# EAGLE design lines_master (EAGLE 8.1.1)

## Sheet 1 of 4: Master processor
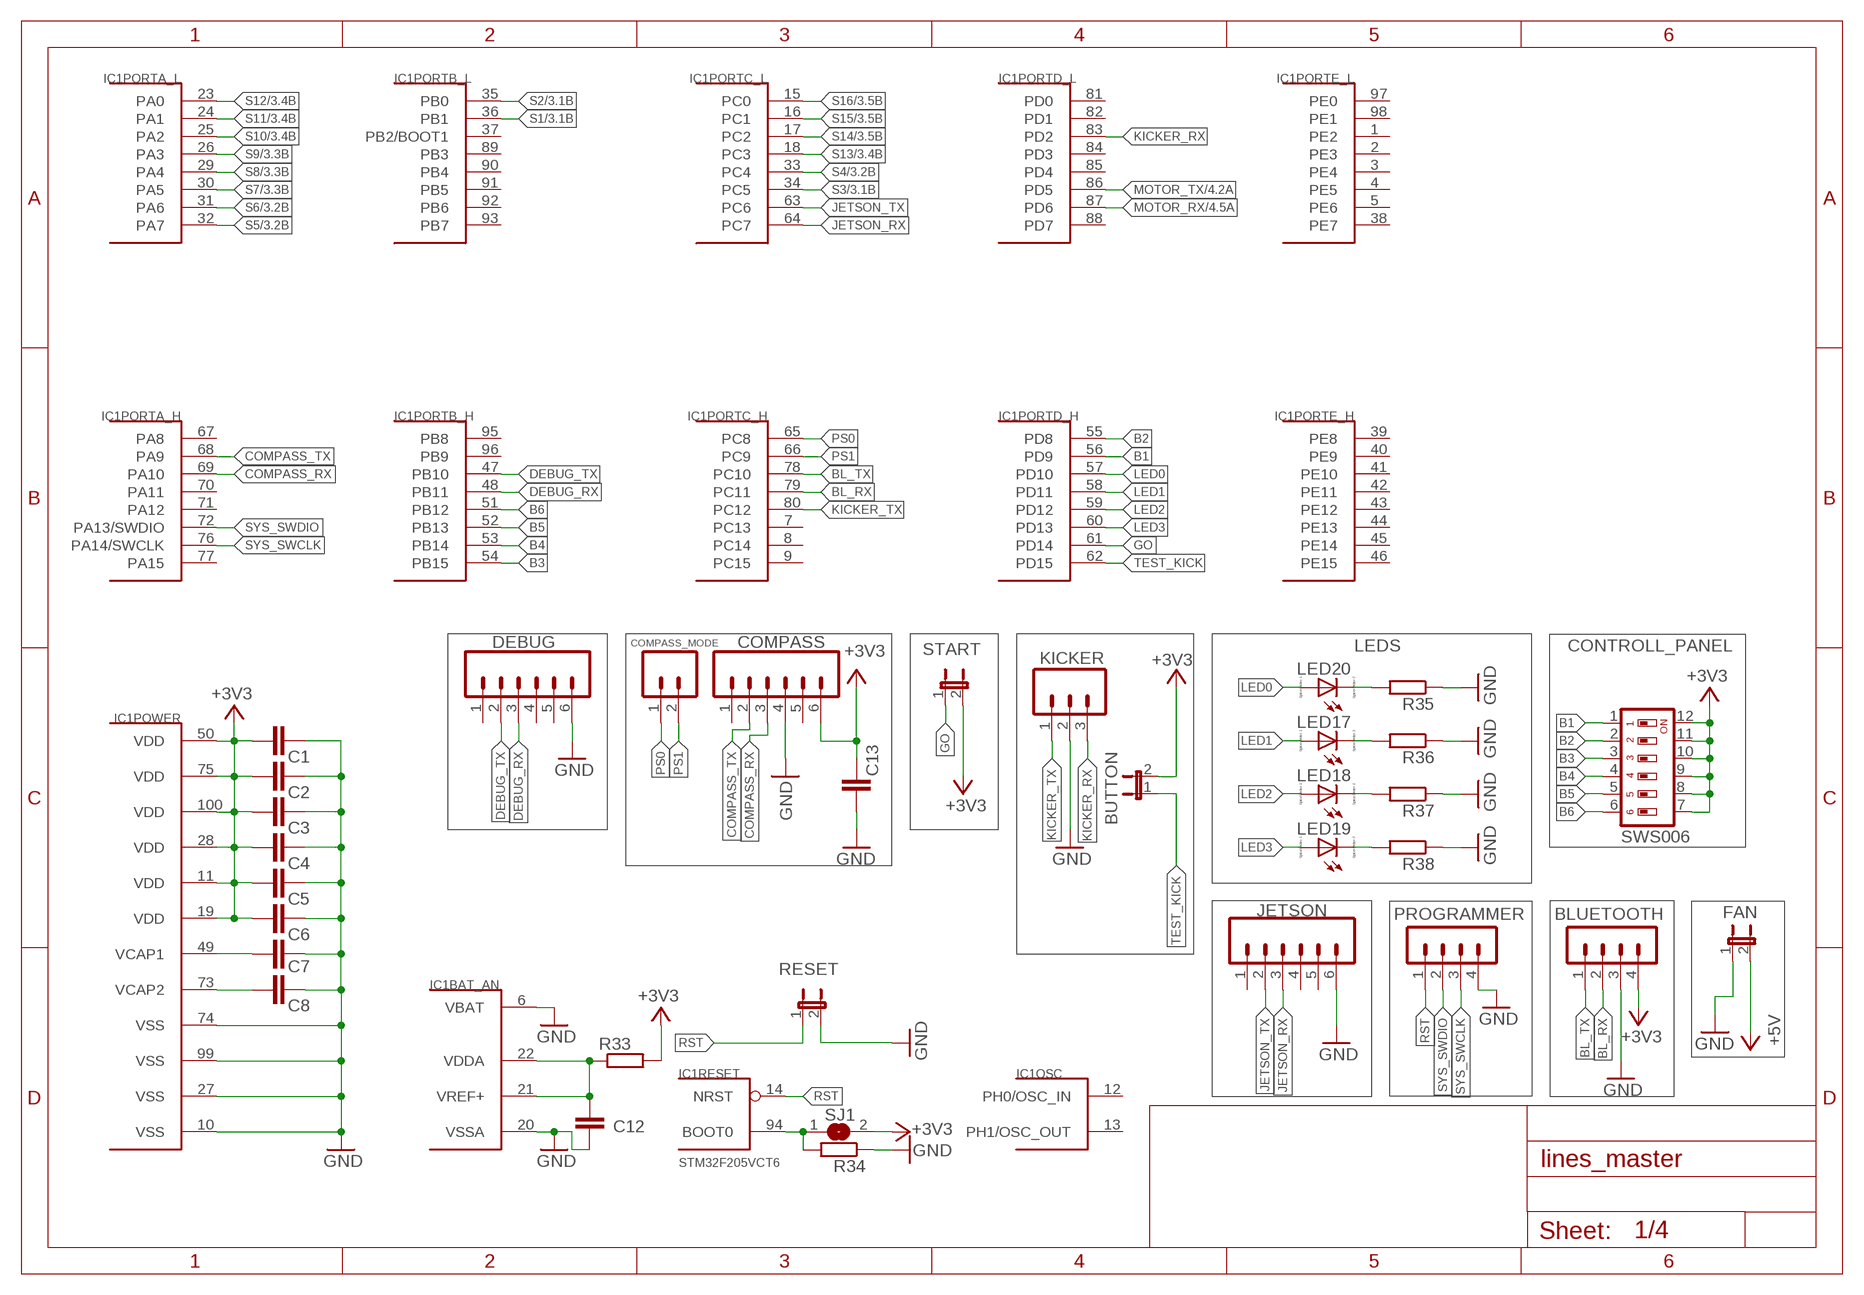
[diagram p0: schematic, sheet 1]

### Parts
BLUETOOTH  MA04-1  [MA04-1]
BUTTON  JP1E  [JP1]
C1  100K  C-EUC0603  [C0603]
C2  100K  C-EUC0603  [C0603]
C3  100K  C-EUC0603  [C0603]
C4  100K  C-EUC0603  [C0603]
C5  100K  C-EUC0603  [C0603]
C6  100K  C-EUC0603  [C0603]
C7  2M2  C-EUC0805  [C0805]
C8  2M2  C-EUC0805  [C0805]
C12  100K  C-EUC0603  [C0603]
C13  100K  C-EUC0603  [C0603]
COMPASS  M06  [06P]
COMPASS_MODE  M02  [02P]
CONTROLL_PANEL  SWS006  [SMS-006]
DEBUG  M06  [06P]
FAN  JP1E  [JP1]
IC1  STM32F205VCT6  [TQFP100]
JETSON  M06  [06P]
KICKER  M03  [03P]
LED17  LED_E  [LED_1206]
LED18  LED_E  [LED_1206]
LED19  LED_E  [LED_1206]
LED20  LED_E  [LED_1206]
PROGRAMMER  MA04-1  [MA04-1]
R33  R-EU_R1206  [R1206]
R34  R-EU_R0603  [R0603]
R35  R-EU_R0603  [R0603]
R36  R-EU_R0603  [R0603]
R37  R-EU_R0603  [R0603]
R38  R-EU_R0603  [R0603]
RESET  JP1E  [JP1]
SJ1  SJ  [SJ]
START  JP1E  [JP1]

### Nets
+3V3: BLUETOOTH.4 BUTTON.2 C1.2 C2.2 C3.2 C4.2 C5.2 C6.2 C13.1 COMPASS.6 CONTROLL_PANEL.7 CONTROLL_PANEL.8 CONTROLL_PANEL.9 CONTROLL_PANEL.10 CONTROLL_PANEL.11 CONTROLL_PANEL.12 IC1.11(POWER:VDD) IC1.19(POWER:VDD) IC1.28(POWER:VDD) IC1.50(POWER:VDD) IC1.75(POWER:VDD) IC1.100(POWER:VDD) R33.2 SJ1.2 START.2 ; also sheet 2,3
+5V: FAN.2 ; also sheet 2
B1: CONTROLL_PANEL.1 IC1.56(PORTD_H:PD9)
B2: CONTROLL_PANEL.2 IC1.55(PORTD_H:PD8)
B3: CONTROLL_PANEL.3 IC1.54(PORTB_H:PB15)
B4: CONTROLL_PANEL.4 IC1.53(PORTB_H:PB14)
B5: CONTROLL_PANEL.5 IC1.52(PORTB_H:PB13)
B6: CONTROLL_PANEL.6 IC1.51(PORTB_H:PB12)
BL_RX: BLUETOOTH.2 IC1.79(PORTC_H:PC11)
BL_TX: BLUETOOTH.1 IC1.78(PORTC_H:PC10)
COMPASS_RX: COMPASS.3 IC1.69(PORTA_H:PA10)
COMPASS_TX: COMPASS.2 IC1.68(PORTA_H:PA9)
DEBUG_RX: DEBUG.3 IC1.48(PORTB_H:PB11)
DEBUG_TX: DEBUG.2 IC1.47(PORTB_H:PB10)
GND: BLUETOOTH.3 C1.1 C2.1 C3.1 C4.1 C5.1 C6.1 C7.1 C8.1 C12.2 C13.2 COMPASS.4 DEBUG.6 FAN.1 IC1.6(BAT_AN:VBAT) IC1.10(POWER:VSS) IC1.20(BAT_AN:VSSA) IC1.27(POWER:VSS) IC1.74(POWER:VSS) IC1.99(POWER:VSS) JETSON.6 KICKER.2 PROGRAMMER.4 R34.1 R35.1 R36.1 R37.1 R38.1 RESET.2 ; also sheet 2,3,4
GO: IC1.61(PORTD_H:PD14) START.1
JETSON_RX: IC1.64(PORTC_L:PC7) JETSON.3
JETSON_TX: IC1.63(PORTC_L:PC6) JETSON.2
KICKER_RX: IC1.83(PORTD_L:PD2) KICKER.3
KICKER_TX: IC1.80(PORTC_H:PC12) KICKER.1
LED0: IC1.57(PORTD_H:PD10) LED20.A
LED1: IC1.58(PORTD_H:PD11) LED17.A
LED2: IC1.59(PORTD_H:PD12) LED18.A
LED3: IC1.60(PORTD_H:PD13) LED19.A
MOTOR_RX: IC1.87(PORTD_L:PD6) ; also sheet 4
MOTOR_TX: IC1.86(PORTD_L:PD5) ; also sheet 4
N$17: C7.2 IC1.49(POWER:VCAP1)
N$18: C8.2 IC1.73(POWER:VCAP2)
N$19: C12.1 IC1.21(BAT_AN:VREF+) IC1.22(BAT_AN:VDDA) R33.1
N$20: IC1.94(RESET:BOOT0) R34.2 SJ1.1
N$23: LED20.C R35.2
N$24: LED17.C R36.2
N$25: LED18.C R37.2
N$26: LED19.C R38.2
PS0: COMPASS_MODE.1 IC1.65(PORTC_H:PC8)
PS1: COMPASS_MODE.2 IC1.66(PORTC_H:PC9)
RST: IC1.14(RESET:NRST) PROGRAMMER.1 RESET.1
S1: IC1.36(PORTB_L:PB1) ; also sheet 3
S2: IC1.35(PORTB_L:PB0) ; also sheet 3
S3: IC1.34(PORTC_L:PC5) ; also sheet 3
S4: IC1.33(PORTC_L:PC4) ; also sheet 3
S5: IC1.32(PORTA_L:PA7) ; also sheet 3
S6: IC1.31(PORTA_L:PA6) ; also sheet 3
S7: IC1.30(PORTA_L:PA5) ; also sheet 3
S8: IC1.29(PORTA_L:PA4) ; also sheet 3
S9: IC1.26(PORTA_L:PA3) ; also sheet 3
S10: IC1.25(PORTA_L:PA2) ; also sheet 3
S11: IC1.24(PORTA_L:PA1) ; also sheet 3
S12: IC1.23(PORTA_L:PA0) ; also sheet 3
S13: IC1.18(PORTC_L:PC3) ; also sheet 3
S14: IC1.17(PORTC_L:PC2) ; also sheet 3
S15: IC1.16(PORTC_L:PC1) ; also sheet 3
S16: IC1.15(PORTC_L:PC0) ; also sheet 3
SYS_SWCLK: IC1.76(PORTA_H:PA14/SWCLK) PROGRAMMER.3
SYS_SWDIO: IC1.72(PORTA_H:PA13/SWDIO) PROGRAMMER.2
TEST_KICK: BUTTON.1 IC1.62(PORTD_H:PD15)
Unconnected: COMPASS.1 COMPASS.5 DEBUG.1 DEBUG.4 DEBUG.5 IC1.1(PORTE_L:PE2) IC1.2(PORTE_L:PE3) IC1.3(PORTE_L:PE4) IC1.4(PORTE_L:PE5) IC1.5(PORTE_L:PE6) IC1.7(PORTC_H:PC13) IC1.8(PORTC_H:PC14) IC1.9(PORTC_H:PC15) IC1.12(OSC:PH0/OSC_IN) IC1.13(OSC:PH1/OSC_OUT) IC1.37(PORTB_L:PB2/BOOT1) IC1.38(PORTE_L:PE7) IC1.39(PORTE_H:PE8) IC1.40(PORTE_H:PE9) IC1.41(PORTE_H:PE10) IC1.42(PORTE_H:PE11) IC1.43(PORTE_H:PE12) IC1.44(PORTE_H:PE13) IC1.45(PORTE_H:PE14) IC1.46(PORTE_H:PE15) IC1.67(PORTA_H:PA8) IC1.70(PORTA_H:PA11) IC1.71(PORTA_H:PA12) IC1.77(PORTA_H:PA15) IC1.81(PORTD_L:PD0) IC1.82(PORTD_L:PD1) IC1.84(PORTD_L:PD3) IC1.85(PORTD_L:PD4) IC1.88(PORTD_L:PD7) IC1.89(PORTB_L:PB3) IC1.90(PORTB_L:PB4) IC1.91(PORTB_L:PB5) IC1.92(PORTB_L:PB6) IC1.93(PORTB_L:PB7) IC1.95(PORTB_H:PB8) IC1.96(PORTB_H:PB9) IC1.97(PORTE_L:PE0) IC1.98(PORTE_L:PE1) JETSON.1 JETSON.4 JETSON.5

### Notes on the sheet
- LEDS

## Sheet 2 of 4: Power management
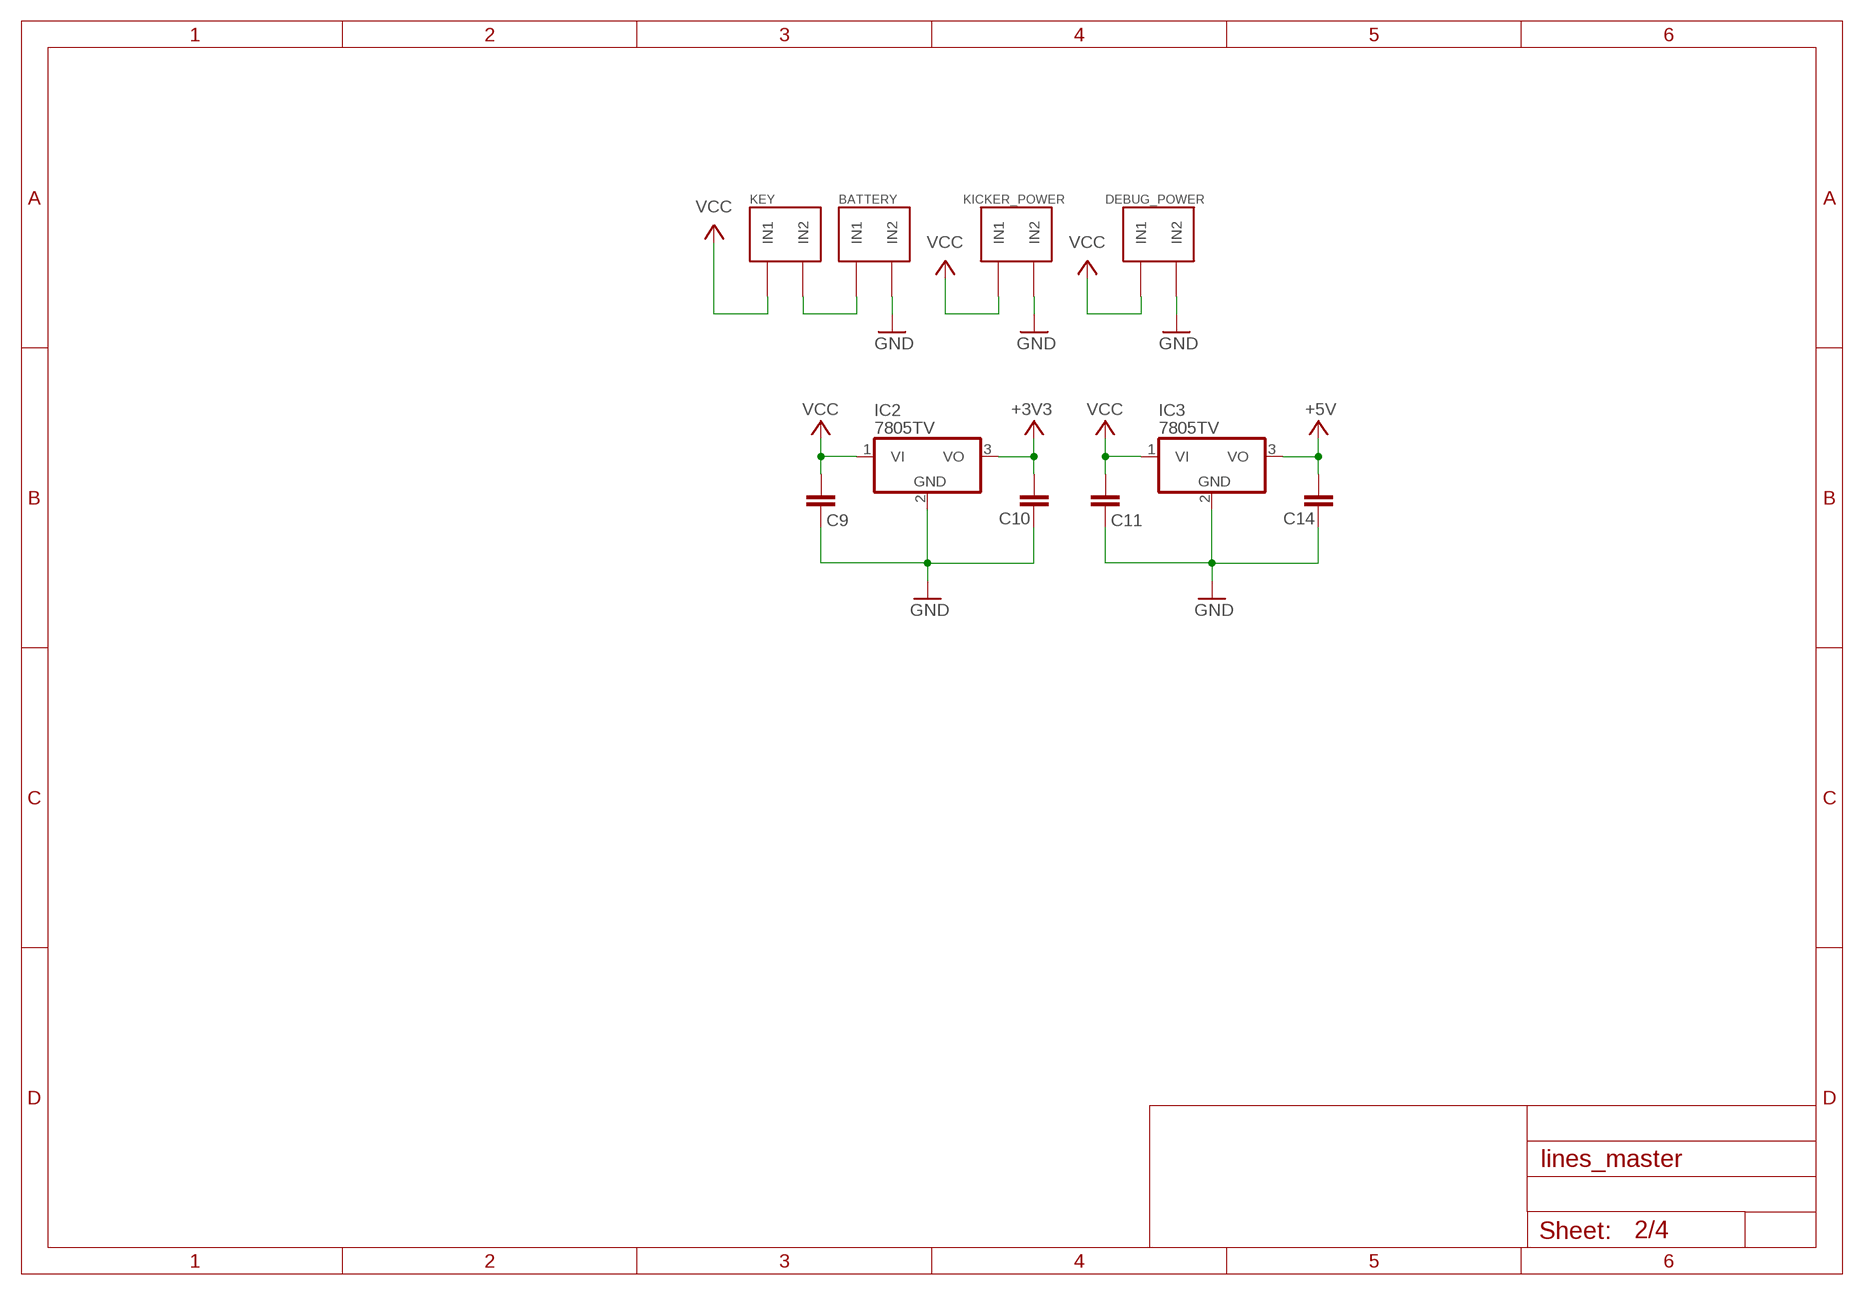
[diagram p1: schematic, sheet 2]

### Parts
BATTERY  MOTOR_CONNECTOR  [MOTOR_CONNECTOR]
C9  100K  C-EUC0603  [C0603]
C10  100K  C-EUC0603  [C0603]
C11  100K  C-EUC0603  [C0603]
C14  100K  C-EUC0603  [C0603]
DEBUG_POWER  MOTOR_CONNECTOR  [MOTOR_CONNECTOR]
IC2  7805TV  [TO220V]
IC3  7805TV  [TO220V]
KEY  MOTOR_CONNECTOR  [MOTOR_CONNECTOR]
KICKER_POWER  MOTOR_CONNECTOR  [MOTOR_CONNECTOR]

### Nets
+3V3: C10.2 IC2.3(VO) ; also sheet 1,3
+5V: C14.2 IC3.3(VO) ; also sheet 1
GND: BATTERY.IN2 C9.1 C10.1 C11.1 C14.1 DEBUG_POWER.IN2 IC2.2(GND) IC3.2(GND) KICKER_POWER.IN2 ; also sheet 1,3,4
N$28: BATTERY.IN1 KEY.IN2
VCC: C9.2 C11.2 DEBUG_POWER.IN1 IC2.1(VI) IC3.1(VI) KEY.IN1 KICKER_POWER.IN1 ; also sheet 4

## Sheet 3 of 4: Line sensors
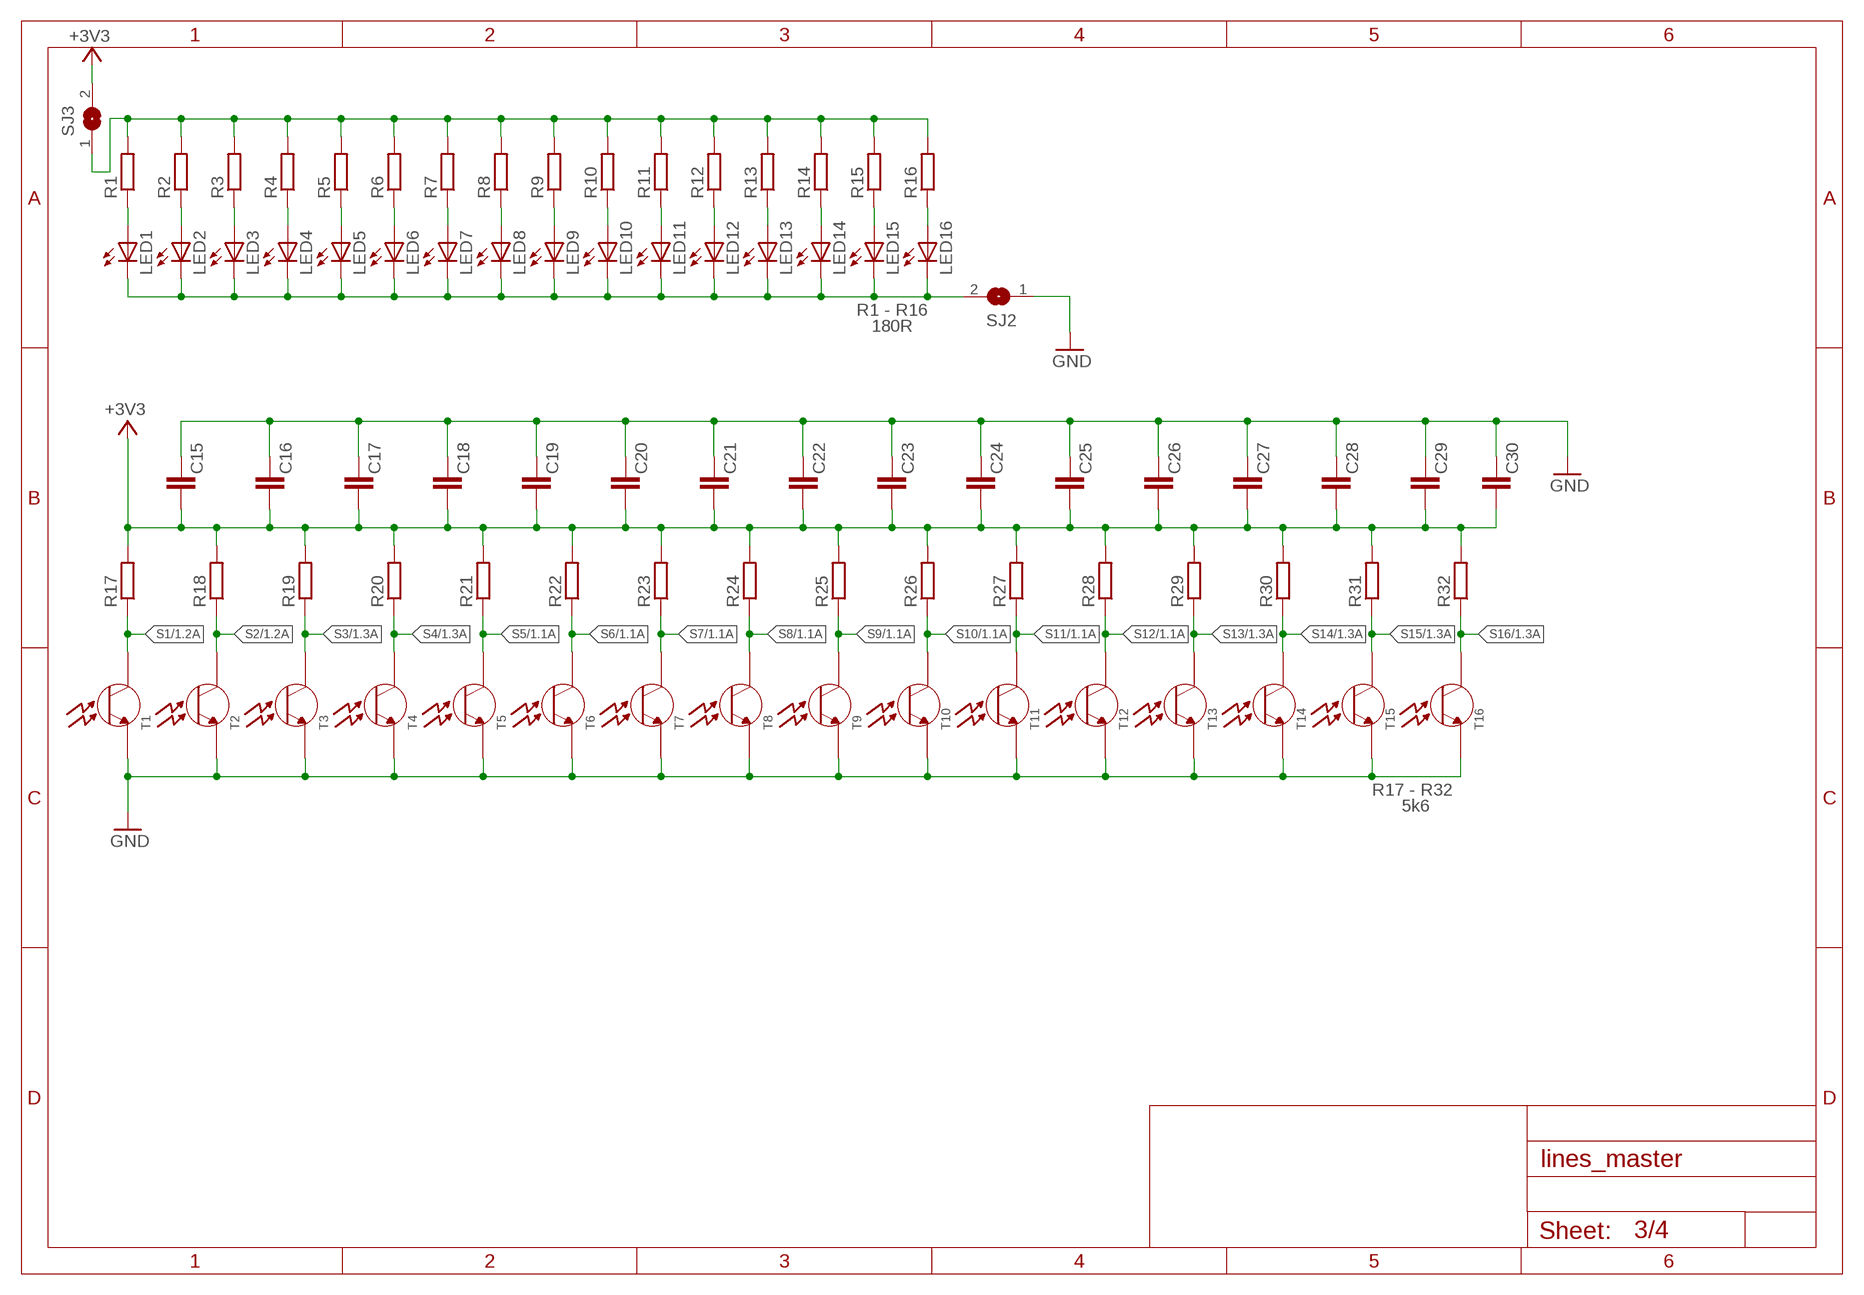
[diagram p2: schematic, sheet 3]

### Parts
C15  100K  C-EUC0603  [C0603]
C16  100K  C-EUC0603  [C0603]
C17  100K  C-EUC0603  [C0603]
C18  100K  C-EUC0603  [C0603]
C19  100K  C-EUC0603  [C0603]
C20  100K  C-EUC0603  [C0603]
C21  100K  C-EUC0603  [C0603]
C22  100K  C-EUC0603  [C0603]
C23  100K  C-EUC0603  [C0603]
C24  100K  C-EUC0603  [C0603]
C25  100K  C-EUC0603  [C0603]
C26  100K  C-EUC0603  [C0603]
C27  100K  C-EUC0603  [C0603]
C28  100K  C-EUC0603  [C0603]
C29  100K  C-EUC0603  [C0603]
C30  100K  C-EUC0603  [C0603]
LED1  LEDKA-3528ASYC  [KA-3528ASYC]
LED2  LEDKA-3528ASYC  [KA-3528ASYC]
LED3  LEDKA-3528ASYC  [KA-3528ASYC]
LED4  LEDKA-3528ASYC  [KA-3528ASYC]
LED5  LEDKA-3528ASYC  [KA-3528ASYC]
LED6  LEDKA-3528ASYC  [KA-3528ASYC]
LED7  LEDKA-3528ASYC  [KA-3528ASYC]
LED8  LEDKA-3528ASYC  [KA-3528ASYC]
LED9  LEDKA-3528ASYC  [KA-3528ASYC]
LED10  LEDKA-3528ASYC  [KA-3528ASYC]
LED11  LEDKA-3528ASYC  [KA-3528ASYC]
LED12  LEDKA-3528ASYC  [KA-3528ASYC]
LED13  LEDKA-3528ASYC  [KA-3528ASYC]
LED14  LEDKA-3528ASYC  [KA-3528ASYC]
LED15  LEDKA-3528ASYC  [KA-3528ASYC]
LED16  LEDKA-3528ASYC  [KA-3528ASYC]
R1  180R  R-EU_R0603  [R0603]
R2  180R  R-EU_R0603  [R0603]
R3  180R  R-EU_R0603  [R0603]
R4  180R  R-EU_R0603  [R0603]
R5  180R  R-EU_R0603  [R0603]
R6  180R  R-EU_R0603  [R0603]
R7  180R  R-EU_R0603  [R0603]
R8  180R  R-EU_R0603  [R0603]
R9  180R  R-EU_R0603  [R0603]
R10  180R  R-EU_R0603  [R0603]
R11  180R  R-EU_R0603  [R0603]
R12  180R  R-EU_R0603  [R0603]
R13  180R  R-EU_R0603  [R0603]
R14  180R  R-EU_R0603  [R0603]
R15  180R  R-EU_R0603  [R0603]
R16  180R  R-EU_R0603  [R0603]
R17  5K6  R-EU_R0603  [R0603]
R18  5K6  R-EU_R0603  [R0603]
R19  5K6  R-EU_R0603  [R0603]
R20  5K6  R-EU_R0603  [R0603]
R21  5K6  R-EU_R0603  [R0603]
R22  5K6  R-EU_R0603  [R0603]
R23  5K6  R-EU_R0603  [R0603]
R24  5K6  R-EU_R0603  [R0603]
R25  5K6  R-EU_R0603  [R0603]
R26  5K6  R-EU_R0603  [R0603]
R27  5K6  R-EU_R0603  [R0603]
R28  5K6  R-EU_R0603  [R0603]
R29  5K6  R-EU_R0603  [R0603]
R30  5K6  R-EU_R0603  [R0603]
R31  5K6  R-EU_R0603  [R0603]
R32  5K6  R-EU_R0603  [R0603]
SJ2  SJ  [SJ]
SJ3  SJ  [SJ]
T1  LL-S150-1A  [LL-S150PTC-1A]
T2  LL-S150-1A  [LL-S150PTC-1A]
T3  LL-S150-1A  [LL-S150PTC-1A]
T4  LL-S150-1A  [LL-S150PTC-1A]
T5  LL-S150-1A  [LL-S150PTC-1A]
T6  LL-S150-1A  [LL-S150PTC-1A]
T7  LL-S150-1A  [LL-S150PTC-1A]
T8  LL-S150-1A  [LL-S150PTC-1A]
T9  LL-S150-1A  [LL-S150PTC-1A]
T10  LL-S150-1A  [LL-S150PTC-1A]
T11  LL-S150-1A  [LL-S150PTC-1A]
T12  LL-S150-1A  [LL-S150PTC-1A]
T13  LL-S150-1A  [LL-S150PTC-1A]
T14  LL-S150-1A  [LL-S150PTC-1A]
T15  LL-S150-1A  [LL-S150PTC-1A]
T16  LL-S150-1A  [LL-S150PTC-1A]

### Nets
+3V3: C15.2 C16.2 C17.2 C18.2 C19.2 C20.2 C21.2 C22.2 C23.2 C24.2 C25.2 C26.2 C27.2 C28.2 C29.2 C30.2 R17.2 R18.2 R19.2 R20.2 R21.2 R22.2 R23.2 R24.2 R25.2 R26.2 R27.2 R28.2 R29.2 R30.2 R31.2 R32.2 SJ3.2 ; also sheet 1,2
GND: C15.1 C16.1 C17.1 C18.1 C19.1 C20.1 C21.1 C22.1 C23.1 C24.1 C25.1 C26.1 C27.1 C28.1 C29.1 C30.1 SJ2.1 T1.E T2.E T3.E T4.E T5.E T6.E T7.E T8.E T9.E T10.E T11.E T12.E T13.E T14.E T15.E T16.E ; also sheet 1,2,4
N$1: LED1.A R1.1
N$2: LED2.A R2.1
N$3: LED3.A R3.1
N$4: LED4.A R4.1
N$5: LED5.A R5.1
N$6: LED6.A R6.1
N$7: LED7.A R7.1
N$8: LED8.A R8.1
N$9: LED9.A R9.1
N$10: LED10.A R10.1
N$11: LED11.A R11.1
N$12: LED12.A R12.1
N$13: LED13.A R13.1
N$14: LED14.A R14.1
N$15: LED15.A R15.1
N$16: LED16.A R16.1
N$21: LED1.C LED2.C LED3.C LED4.C LED5.C LED6.C LED7.C LED8.C LED9.C LED10.C LED11.C LED12.C LED13.C LED14.C LED15.C LED16.C SJ2.2
N$22: R1.2 R2.2 R3.2 R4.2 R5.2 R6.2 R7.2 R8.2 R9.2 R10.2 R11.2 R12.2 R13.2 R14.2 R15.2 R16.2 SJ3.1
S1: R17.1 T1.C ; also sheet 1
S2: R18.1 T2.C ; also sheet 1
S3: R19.1 T3.C ; also sheet 1
S4: R20.1 T4.C ; also sheet 1
S5: R21.1 T5.C ; also sheet 1
S6: R22.1 T6.C ; also sheet 1
S7: R23.1 T7.C ; also sheet 1
S8: R24.1 T8.C ; also sheet 1
S9: R25.1 T9.C ; also sheet 1
S10: R26.1 T10.C ; also sheet 1
S11: R27.1 T11.C ; also sheet 1
S12: R28.1 T12.C ; also sheet 1
S13: R29.1 T13.C ; also sheet 1
S14: R30.1 T14.C ; also sheet 1
S15: R31.1 T15.C ; also sheet 1
S16: R32.1 T16.C ; also sheet 1

### Notes on the sheet
- R1 - R16
     180R
- R17 - R32
        5k6

## Sheet 4 of 4: Motors
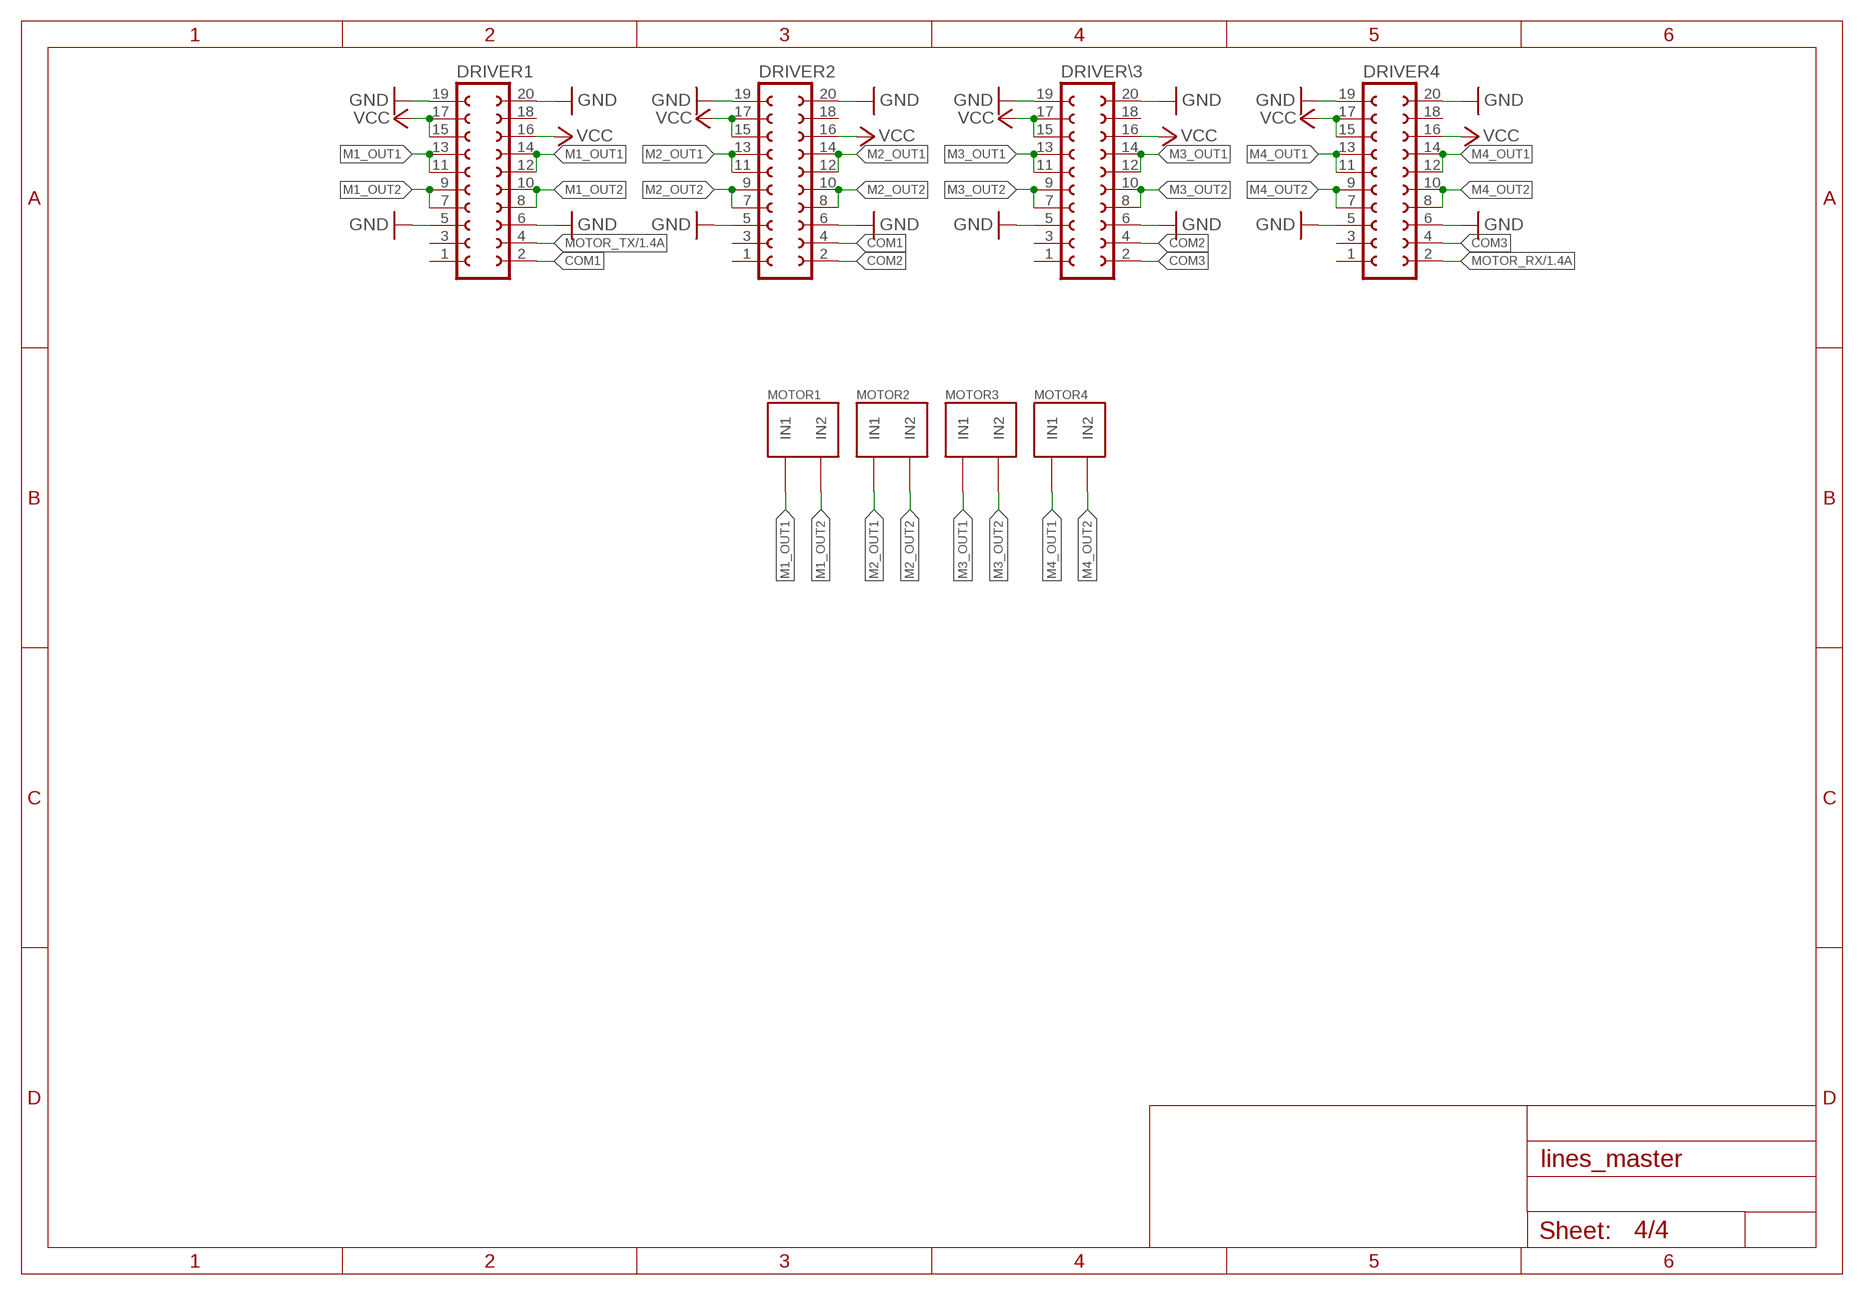
[diagram p3: schematic, sheet 4]

### Parts
DRIVER1  FE10-2  [FE10-2]
DRIVER2  FE10-2  [FE10-2]
DRIVER4  FE10-2  [FE10-2]
DRIVER\3  FE10-2  [FE10-2]
MOTOR1  MOTOR_CONNECTOR  [MOTOR_CONNECTOR]
MOTOR2  MOTOR_CONNECTOR  [MOTOR_CONNECTOR]
MOTOR3  MOTOR_CONNECTOR  [MOTOR_CONNECTOR]
MOTOR4  MOTOR_CONNECTOR  [MOTOR_CONNECTOR]

### Nets
COM1: DRIVER1.2 DRIVER2.4
COM2: DRIVER2.2 DRIVER\3.4
COM3: DRIVER4.4 DRIVER\3.2
GND: DRIVER1.5 DRIVER1.6 DRIVER1.19 DRIVER1.20 DRIVER2.5 DRIVER2.6 DRIVER2.19 DRIVER2.20 DRIVER4.5 DRIVER4.6 DRIVER4.19 DRIVER4.20 DRIVER\3.5 DRIVER\3.6 DRIVER\3.19 DRIVER\3.20 ; also sheet 1,2,3
M1_OUT1: DRIVER1.11 DRIVER1.12 DRIVER1.13 DRIVER1.14 MOTOR1.IN1
M1_OUT2: DRIVER1.7 DRIVER1.8 DRIVER1.9 DRIVER1.10 MOTOR1.IN2
M2_OUT1: DRIVER2.11 DRIVER2.12 DRIVER2.13 DRIVER2.14 MOTOR2.IN1
M2_OUT2: DRIVER2.7 DRIVER2.8 DRIVER2.9 DRIVER2.10 MOTOR2.IN2
M3_OUT1: DRIVER\3.11 DRIVER\3.12 DRIVER\3.13 DRIVER\3.14 MOTOR3.IN1
M3_OUT2: DRIVER\3.7 DRIVER\3.8 DRIVER\3.9 DRIVER\3.10 MOTOR3.IN2
M4_OUT1: DRIVER4.11 DRIVER4.12 DRIVER4.13 DRIVER4.14 MOTOR4.IN1
M4_OUT2: DRIVER4.7 DRIVER4.8 DRIVER4.9 DRIVER4.10 MOTOR4.IN2
MOTOR_RX: DRIVER4.2 ; also sheet 1
MOTOR_TX: DRIVER1.4 ; also sheet 1
VCC: DRIVER1.15 DRIVER1.16 DRIVER1.17 DRIVER2.15 DRIVER2.16 DRIVER2.17 DRIVER4.15 DRIVER4.16 DRIVER4.17 DRIVER\3.15 DRIVER\3.16 DRIVER\3.17 ; also sheet 2
Unconnected: DRIVER1.1 DRIVER1.3 DRIVER1.18 DRIVER2.1 DRIVER2.3 DRIVER2.18 DRIVER4.1 DRIVER4.3 DRIVER4.18 DRIVER\3.1 DRIVER\3.3 DRIVER\3.18

## Library data of the parts
BATTERY DEBUG_POWER KEY KICKER_POWER MOTOR1-MOTOR4 = motor_connector:MOTOR_CONNECTOR
BLUETOOTH PROGRAMMER = con-lstb:MA04-1: PIN HEADER; OC_FARNELL: unknown; OC_NEWARK: unknown
BUTTON FAN RESET START = jumper:JP1E: JUMPER
C1-C30 = rcl:C-EU: CAPACITOR, European symbol
COMPASS DEBUG JETSON = con-amp-quick:M06: AMP QUICK CONNECTOR; OC_FARNELL: unknown; OC_NEWARK: unknown
COMPASS_MODE = con-amp-quick:M02: AMP QUICK CONNECTOR; OC_FARNELL: unknown; OC_NEWARK: unknown
CONTROLL_PANEL = smd-special:SWS006: SMD Dip Switch 6 pol.
DRIVER1 DRIVER2 DRIVER4 DRIVER\3 = con-lsta:FE10-2: FEMALE HEADER; OC_FARNELL: unknown; OC_NEWARK: unknown
IC1 = stm32f205:STM32F205VCT6: STM32F101/103 100 pin LQFP
IC2 IC3 = linear:78*: Positive VOLTAGE REGULATOR Source: http://cache.national.com/ds/LM/LM78L05.pdf http://www.fairchildsemi.com/ds/LM/LM7805.pdf
KICKER = con-amp-quick:M03: AMP QUICK CONNECTOR; OC_FARNELL: unknown; OC_NEWARK: unknown
LED1-LED16 = led:LED: LED OSRAM: - CHIPLED LG R971, LG N971, LY N971, LG Q971, LY Q971, LO R971, LY R971 LH N974, LH R974 LS Q976, LO Q976, LY Q976 LO Q996 - Hyper CHIPLED LW Q18S LB Q993, LB Q99A, LB R99A - SideLED LS A670, LO A670, LY A670, LG A670, LP A670 LB A673, LV A673, LT A673, LW A673 LH A674 LY A675 LS A676, LA A676, LO A676, LY A676, LW A676 LS A679, LY A679, LG A679 - Hyper Micro SIDELED® LS Y876, LA Y876, LO Y876, LY Y876 LT Y87S - SmartLED LW L88C, LW L88S LB L89C, LB L89S, LG L890 LS L89K, LO L89K, LY L89K LS L896, LA L896, LO L896, LY L896 - TOPLED LS T670, LO T670, LY T670, LG T670, LP T670 LSG T670, LSP T670, LSY T670, LOP T670, LYG T670 LG T671, LOG T671, LSG T671 LB T673, LV T673, LT T673, LW T673 LH T674 LS T676, LA T676, LO T676, LY T676, LB T676, LH T676, LSB T676, LW T676 LB T67C, LV T67C, LT T67C, LS T67K, LO T67K, LY T67K, LW E67C LS E67B, LA E67B, LO E67B, LY E67B, LB E67C, LV E67C, LT E67C LW T67C LS T679, LY T679, LG T679 LS T770, LO T770, LY T770, LG T770, LP T770 LB T773, LV T773, LT T773, LW T773 LH T774 LS E675, LA E675, LY E675, LS T675 LS T776, LA T776, LO T776, LY T776, LB T776 LHGB T686 LT T68C, LB T68C - Hyper Mini TOPLED® LB M676 - Mini TOPLED Santana® LG M470 LS M47K, LO M47K, LY M47K Source: http://www.osram.convergy.de LUXEON: - LUMILED® LXK2-PW12-R00, LXK2-PW12-S00, LXK2-PW14-U00, LXK2-PW14-V00 LXK2-PM12-R00, LXK2-PM12-S00, LXK2-PM14-U00 LXK2-PE12-Q00, LXK2-PE12-R00, LXK2-PE12-S00, LXK2-PE14-T00, LXK2-PE14-U00 LXK2-PB12-K00, LXK2-PB12-L00, LXK2-PB12-M00, LXK2-PB14-N00, LXK2-PB14-P00, LXK2-PB14-Q00 LXK2-PR12-L00, LXK2-PR12-M00, LXK2-PR14-Q00, LXK2-PR14-R00 LXK2-PD12-Q00, LXK2-PD12-R00, LXK2-PD12-S00 LXK2-PH12-R00, LXK2-PH12-S00 LXK2-PL12-P00, LXK2-PL12-Q00, LXK2-PL12-R00 Source: www.luxeon.com KINGBRIGHT: KA-3528ASYC Source: www.kingbright.com
LED17-LED20 = eagle-ltspice:LED_E: LED Source: http://www.osram.convergy.de Source: www.luxeon.com Source: www.kingbright.com; SPICEMODEL: NONE; SPICEPREFIX: D; SPICETYPE: diode
R1-R38 = rcl:R-EU_: RESISTOR, European symbol
SJ1-SJ3 = jumper:SJ: SMD solder JUMPER
T1-T16 = phototransistor:LL-S150-1A: 1206 phototransistor

## Board
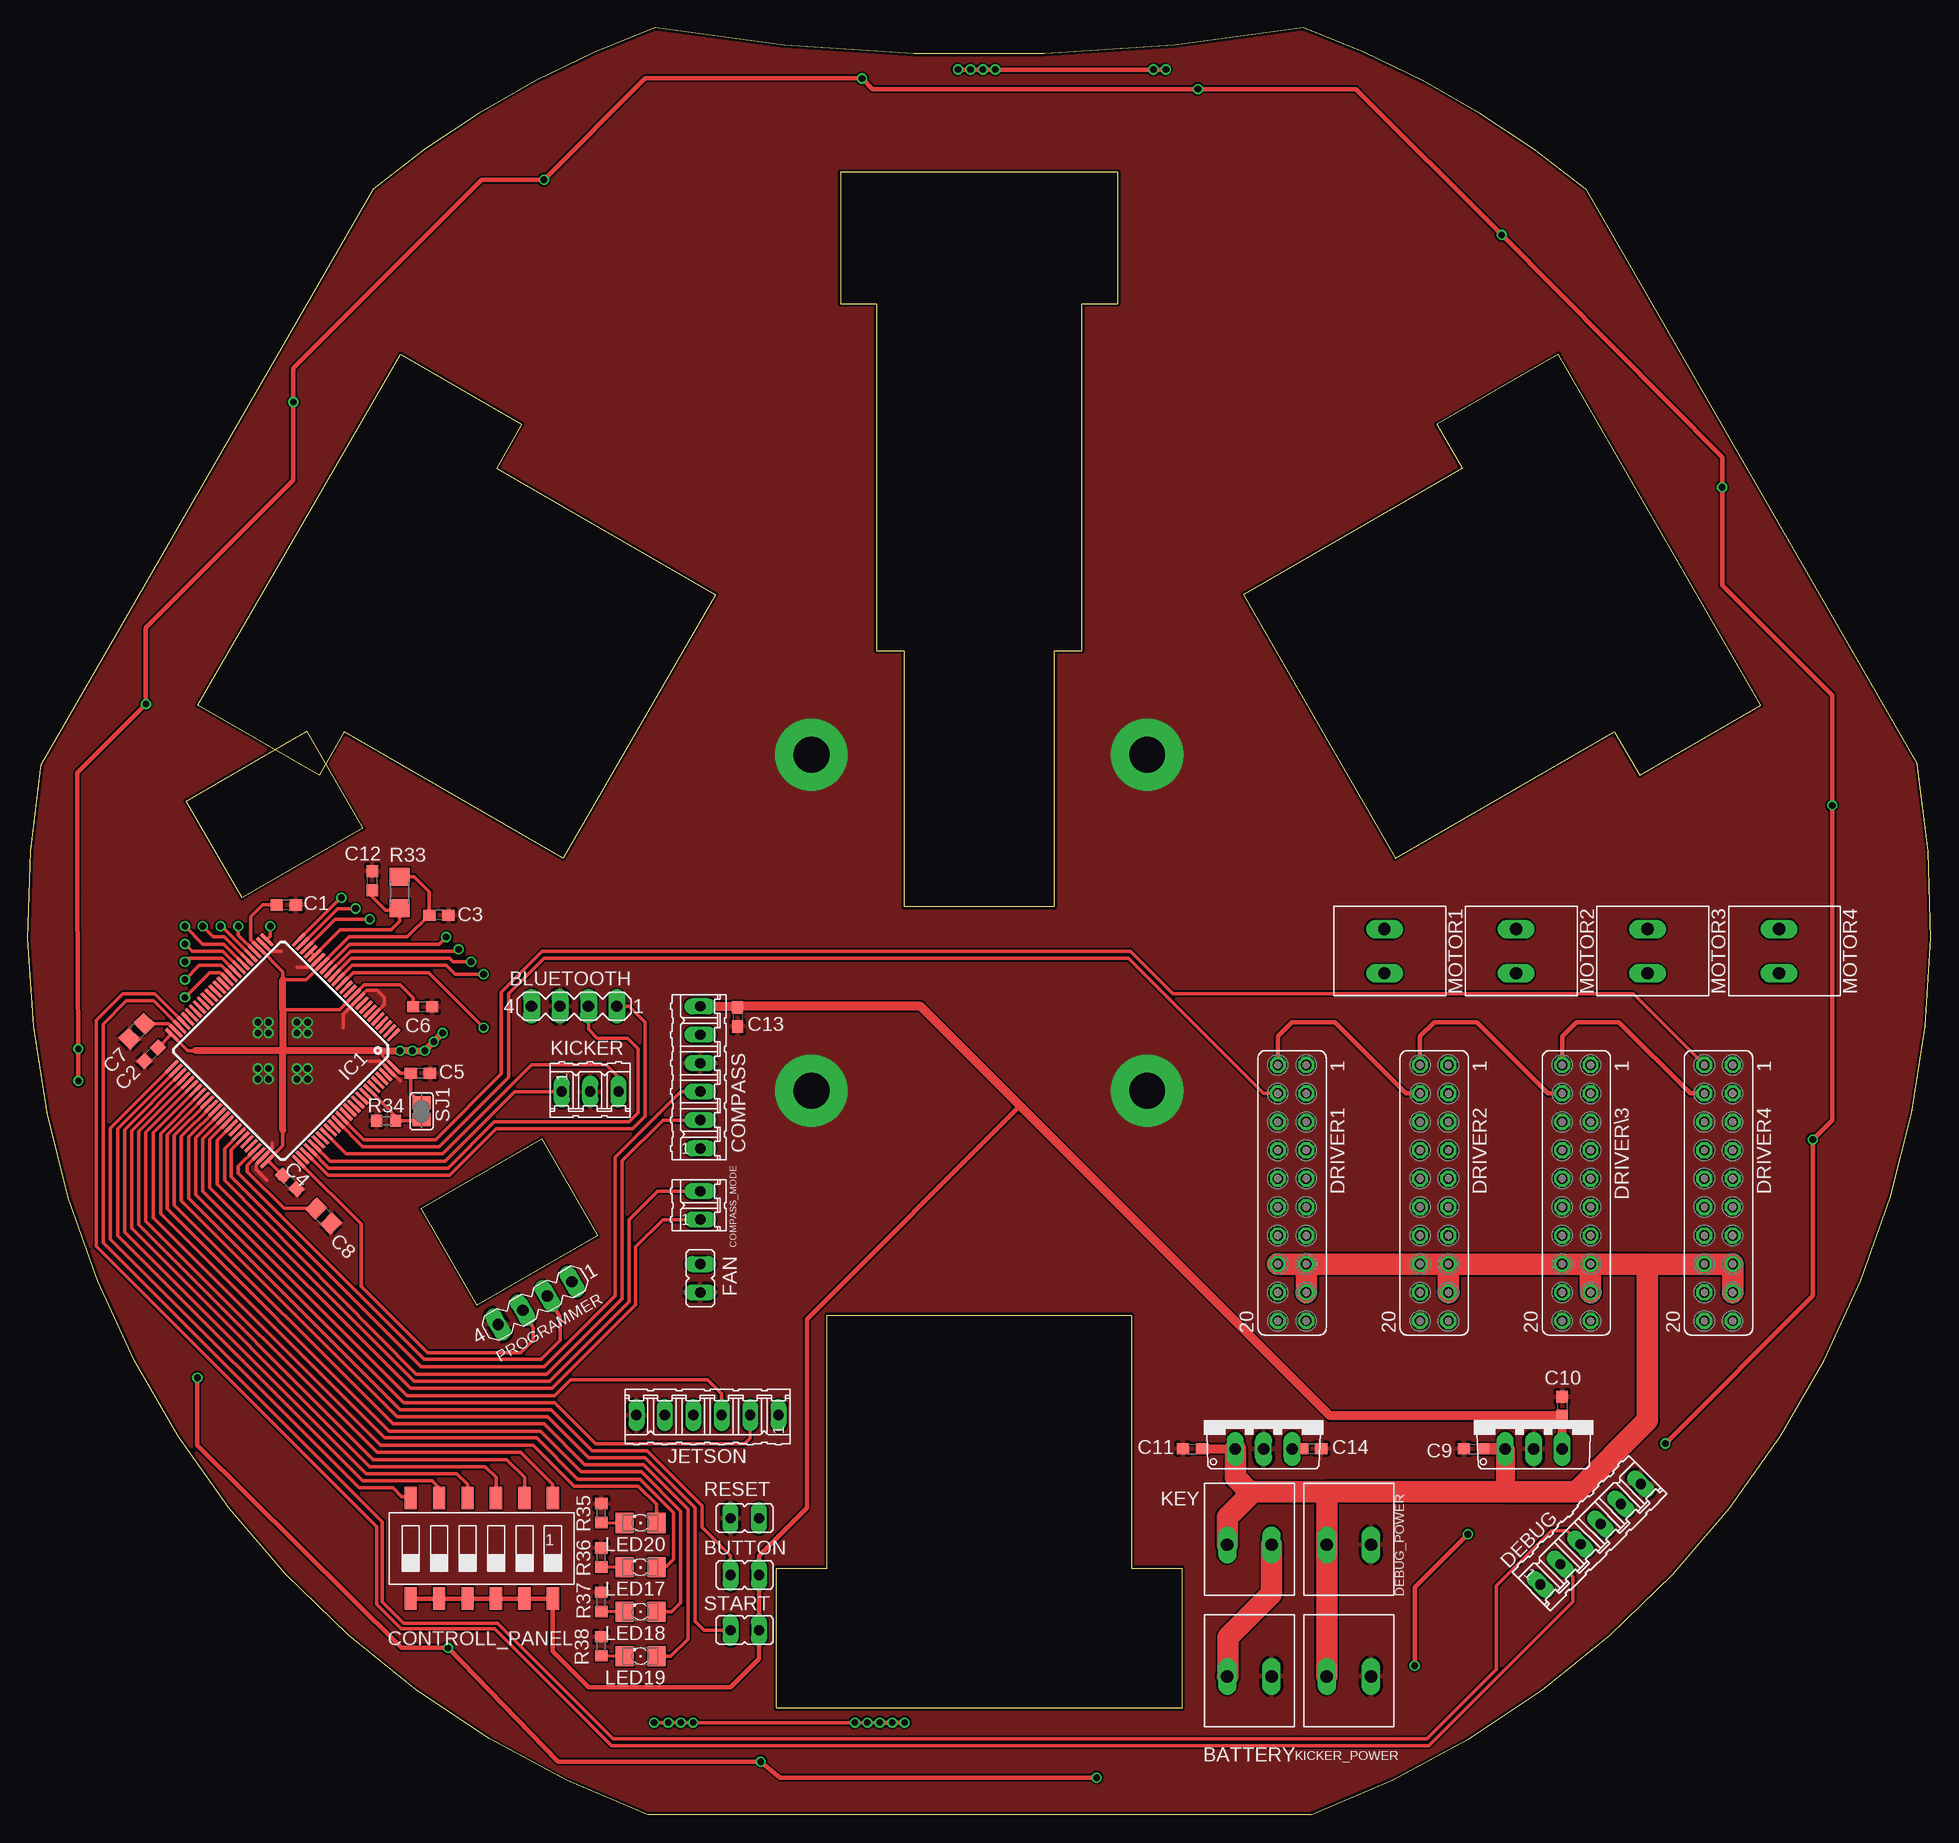
[diagram p4: board, top side]
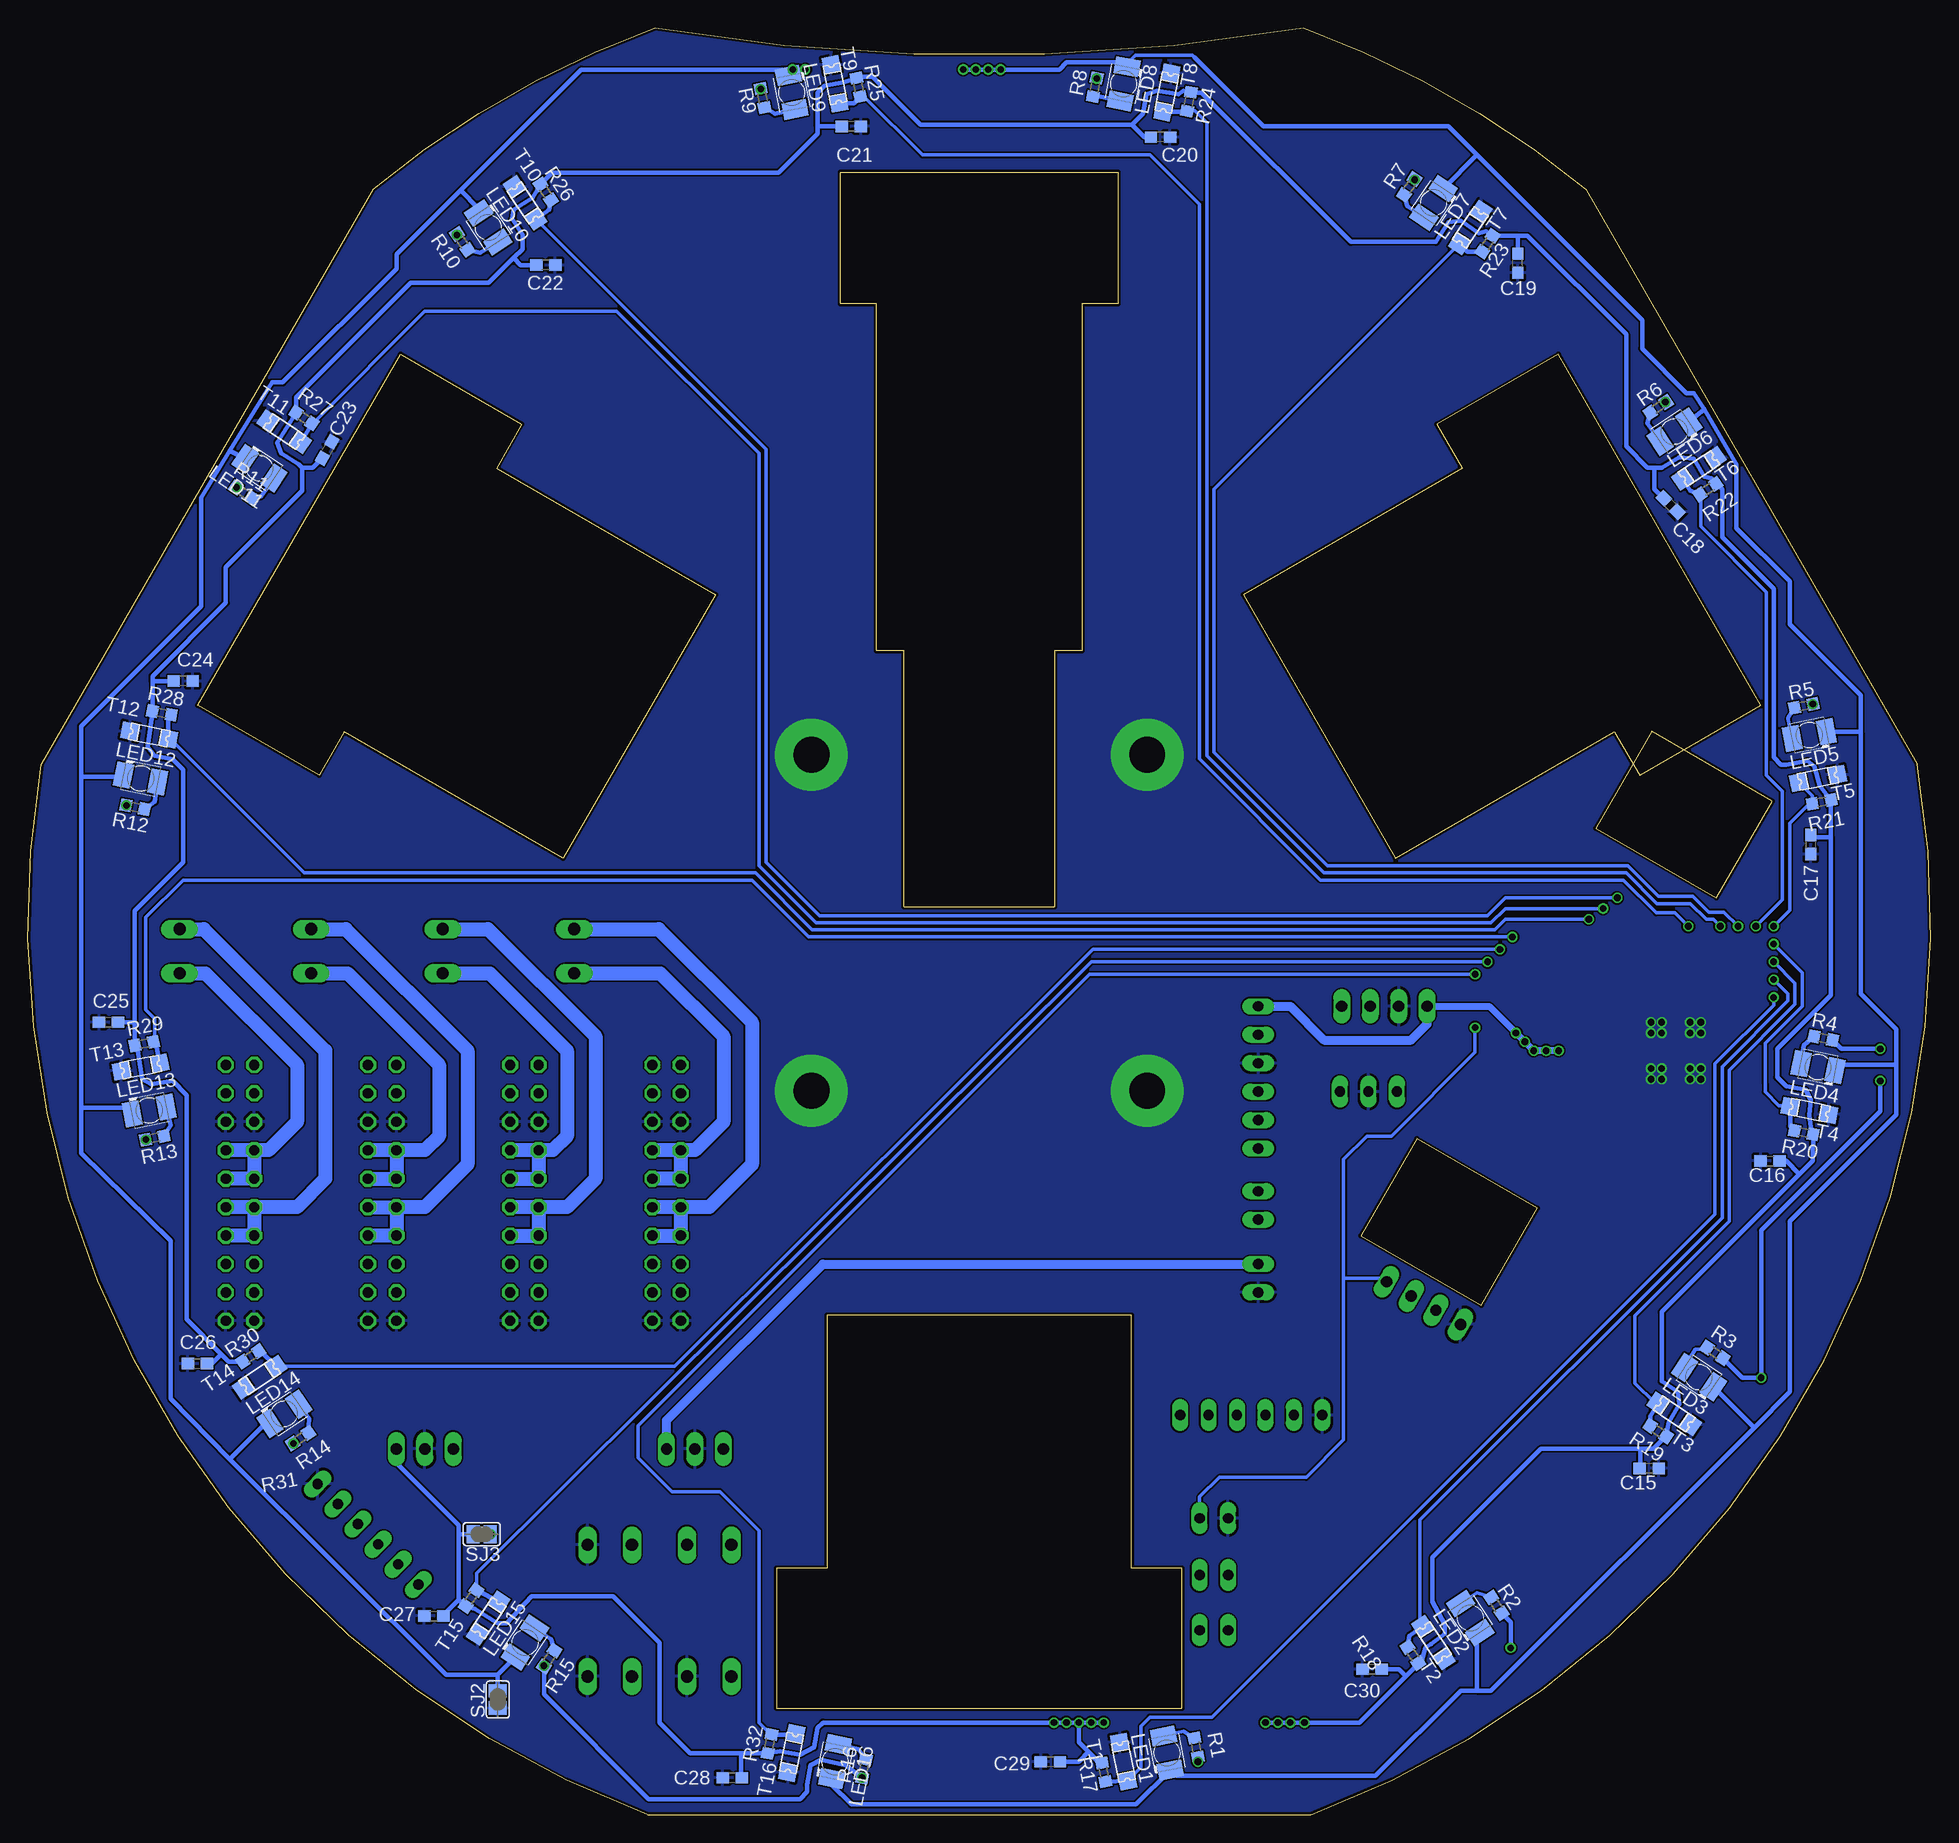
[diagram p5: board, bottom side, seen from below]

Size 169.98 x 159.58 mm. Coordinates in mm from the lower left corner, seen from the top.
Outline: 30.82,145.17 1.18,93.82 arc79 55.34,0 114.63,0 arc79 168.8,93.82 139.16,145.17 arc20 113.95,159.58 arc-19 56.03,159.58 arc20 30.82,145.17
Outline: 91.71,81.08 78.27,81.08 78.27,103.93 75.82,103.93 75.82,134.95 72.59,134.95 72.59,146.69 97.39,146.69 97.39,134.95 94.16,134.95 94.16,103.93 91.71,103.93 91.71,81.08
Outline: 40.13,45.5 35.13,54.16 45.91,60.38 50.91,51.72 40.13,45.5
Outline: 19.13,81.88 14.13,90.53 24.91,96.76 29.91,88.09 19.13,81.88
Outline: 136.7,130.42 125.88,124.17 128.13,120.27 108.56,108.98 122.16,85.42 141.73,96.72 143.98,92.82 154.8,99.07 136.7,130.42
Outline: 33.28,130.42 44.1,124.17 41.85,120.27 61.41,108.98 47.81,85.42 28.25,96.72 26,92.82 15.18,99.07 33.28,130.42
Outline: 98.59,44.59 98.59,22 103.09,22 103.09,9.5 66.89,9.5 66.89,22 71.39,22 71.39,44.59 98.59,44.59
Copper layers (1*16): Top 0.035mm / dielectric 1.5mm / Bottom 0.035mm
Design rules "ITEADstudio_DRC": minimum track width 6mil, minimum drill 12mil, track to track 6mil, track to pad 6mil, pad to pad 6mil, via to via 6mil, smd to smd 0mil, copper to edge 10mil, drill to drill 10mil, minimum pad ring 10mil, minimum via ring 6mil, stop-mask expansion 2mil, vias tented up to drill 100mil, thermal gap 10mil

### Footprints (pad centres in the part's own frame; a part is rotated, then mirrored left to right if it is on the bottom)
MOTOR_CONNECTOR = drill 1.1 long: IN1 -1.98,0; IN2 1.98,0
MA04-1 = drill 1.016 long: 1 -3.81,0; 2 -1.27,0; 3 1.27,0; 4 3.81,0
JP1 = drill 0.914 long: 1 0,-1.27; 2 0,1.27
C0603 = smd 1.1 x 1: 1 -0.85,0; 2 0.85,0
C0805 = smd 1.3 x 1.5: 1 -0.95,0; 2 0.95,0
06P = drill 0.914 long: 1 -6.35,0; 2 -3.81,0; 3 -1.27,0; 4 1.27,0; 5 3.81,0; 6 6.35,0
02P = drill 0.914 long: 1 -1.27,0; 2 1.27,0
SMS-006 = smd 1.092 x 2.007: 1 -6.35,-4.496; 2 -3.81,-4.496; 3 -1.27,-4.496; 4 1.27,-4.496; 5 3.81,-4.496; 6 6.35,-4.496; 7 6.35,4.496; 8 3.81,4.496; 9 1.27,4.496; 10 -1.27,4.496; 11 -3.81,4.496; 12 -6.35,4.496
FE10-2 = drill 0.914 octagon: 1 -11.43,1.27; 2 -11.43,-1.27; 3 -8.89,1.27; 4 -8.89,-1.27; 5 -6.35,1.27; 6 -6.35,-1.27; 7 -3.81,1.27; 8 -3.81,-1.27; 9 -1.27,1.27; 10 -1.27,-1.27; 11 1.27,1.27; 12 1.27,-1.27; 13 3.81,1.27; 14 3.81,-1.27; 15 6.35,1.27; 16 6.35,-1.27; 17 8.89,1.27; 18 8.89,-1.27; 19 11.43,1.27; 20 11.43,-1.27
TQFP100 = smd 1.5 x 0.297: 1 -8,6; 2 -8,5.5; 3 -8,5; 4 -8,4.5; 5 -8,4; 6 -8,3.5; 7 -8,3; 8 -8,2.5; 9 -8,2; 10 -8,1.5; 11 -8,1; 12 -8,0.5; 13 -8,0; 14 -8,-0.5; 15 -8,-1; 16 -8,-1.5; 17 -8,-2; 18 -8,-2.5; 19 -8,-3; 20 -8,-3.5; 21 -8,-4; 22 -8,-4.5; 23 -8,-5; 24 -8,-5.5; 25 -8,-6; 51 8,-6; 52 8,-5.5; 53 8,-5; 54 8,-4.5; 55 8,-4; 56 8,-3.5; 57 8,-3; 58 8,-2.5; 59 8,-2; 60 8,-1.5; 61 8,-1; 62 8,-0.5; 63 8,0; 64 8,0.5; 65 8,1; 66 8,1.5; 67 8,2; 68 8,2.5; 69 8,3; 70 8,3.5; 71 8,4; 72 8,4.5; 73 8,5; 74 8,5.5; 75 8,6 | smd 0.297 x 1.5: 26 -6,-8; 27 -5.5,-8; 28 -5,-8; 29 -4.5,-8; 30 -4,-8; 31 -3.5,-8; 32 -3,-8; 33 -2.5,-8; 34 -2,-8; 35 -1.5,-8; 36 -1,-8; 37 -0.5,-8; 38 0,-8; 39 0.5,-8; 40 1,-8; 41 1.5,-8; 42 2,-8; 43 2.5,-8; 44 3,-8; 45 3.5,-8; 46 4,-8; 47 4.5,-8; 48 5,-8; 49 5.5,-8; 50 6,-8; 76 6,8; 77 5.5,8; 78 5,8; 79 4.5,8; 80 4,8; 81 3.5,8; 82 3,8; 83 2.5,8; 84 2,8; 85 1.5,8; 86 1,8; 87 0.5,8; 88 0,8; 89 -0.5,8; 90 -1,8; 91 -1.5,8; 92 -2,8; 93 -2.5,8; 94 -3,8; 95 -3.5,8; 96 -4,8; 97 -4.5,8; 98 -5,8; 99 -5.5,8; 100 -6,8
TO220V = drill 1.016 long: 1 -2.54,-2.54; 2 0,-2.54; 3 2.54,-2.54
03P = drill 0.914 long: 1 -2.54,0; 2 0,0; 3 2.54,0
KA-3528ASYC = smd 1.5 x 2.2: A -1.55,0; C 1.55,0
LED_1206 = smd 1.6 x 1.803: A -1.422,0; C 1.422,0
R0603 = smd 1 x 1.1: 1 -0.85,0; 2 0.85,0
R1206 = smd 1.6 x 1.803: 1 -1.422,0; 2 1.422,0
SJ = smd 1.168 x 1.6: 1 -0.762,0; 2 0.762,0
LL-S150PTC-1A = smd 1.5 x 1.5: C 1.75,0; E -1.75,0

### Placement (x,y rotation side)
BATTERY  109.12,12.35 0 top
BLUETOOTH  48.79,72.2 180 top
BUTTON  64.03,21.4 270 top
C1  23.08,81.25 180 top
C2  11.01,67.92 45 top
C3  36.71,80.34 180 top
C4  23.39,56.49 135 top
C5  35.06,66.22 180 top
C6  35.25,72.16 180 top
C7  9.74,69.98 45 top
C8  26.41,53.47 135 top
C9  129.12,32.67 0 top
C10  137.06,36.48 270 top
C11  104.04,32.67 0 top
C12  30.76,83.41 90 top
C13  63.4,71.25 270 top
C14  114.67,32.67 180 top
C15  25.14,30.93 180 bottom
C16  14.34,58.39 0 bottom
C17  10.69,86.65 90 bottom
C18  23.23,116.97 135 bottom
C19  36.89,138.56 90 bottom
C20  68.8,149.83 180 bottom
C21  96.42,150.78 180 bottom
C22  123.72,138.4 180 bottom
C23  143.25,121.89 240 bottom
C24  156.11,101.25 180 bottom
C25  162.78,70.77 0 bottom
C26  154.84,40.29 0 bottom
C27  133.72,17.75 0 bottom
C28  107.05,3.3 0 bottom
C29  78.64,4.73 0 bottom
C30  49.9,12.99 0 bottom
COMPASS  60.06,65.85 90 top
COMPASS_MODE  60.06,54.42 90 top
CONTROLL_PANEL  40.54,23.78 180 top
DEBUG  139.6,25.05 45 top
DEBUG_POWER  118.01,24.1 0 top
DRIVER1  112.93,55.53 270 top
DRIVER2  125.63,55.53 270 top
DRIVER4  151.03,55.53 270 top
DRIVER\3  138.33,55.53 270 top
FAN  60.06,47.91 0 top
IC1  22.76,68.23 225 top
IC2  134.52,35.21 0 top
IC3  110.39,35.21 0 top
JETSON  60.7,35.69 180 top
KEY  109.12,24.1 0 top
KICKER  50.22,64.58 0 top
KICKER_POWER  118.01,12.35 0 top
LED1  68.23,5.51 281.2 bottom
LED2  41.12,17.57 303.7 bottom
LED3  20.7,39.08 326.2 bottom
LED4  10.06,66.77 348.7 bottom
LED5  10.83,96.43 11.2 bottom
LED6  22.89,123.53 33.7 bottom
LED7  44.41,143.95 56.2 bottom
LED8  72.1,154.59 78.7 bottom
LED9  101.75,153.82 101.2 bottom
LED10  128.85,141.76 123.7 bottom
LED11  149.28,120.25 146.2 bottom
LED12  159.91,92.55 168.7 bottom
LED13  159.14,62.9 191.2 bottom
LED14  147.08,35.8 213.7 bottom
LED15  125.57,15.37 236.2 bottom
LED16  97.88,4.74 258.7 bottom
LED17  54.72,22.09 180 top
LED18  54.72,18.12 180 top
LED19  54.72,14.15 180 top
LED20  54.72,26.06 180 top
MOTOR1  121.18,77.12 270 top
MOTOR2  132.93,77.12 270 top
MOTOR3  144.68,77.12 270 top
MOTOR4  156.43,77.12 270 top
PROGRAMMER  45.3,45.69 210 top
R1  65.62,6 281.2 bottom
R2  38.79,18.7 303.7 bottom
R3  19.27,41.25 326.2 bottom
R4  9.58,69.34 348.7 bottom
R5  11.33,99.03 11.2 bottom
R6  24.35,125.7 33.7 bottom
R7  46.57,145.39 56.2 bottom
R8  74.67,154.28 78.7 bottom
R9  104.36,153.32 101.2 bottom
R10  131.18,140.46 123.7 bottom
R11  150.71,118.08 146.2 bottom
R12  160.39,89.98 168.7 bottom
R13  158.65,60.45 191.2 bottom
R14  145.63,33.63 213.7 bottom
R15  123.41,13.94 236.2 bottom
R16  95.31,4.1 258.7 bottom
R17  73.88,3.78 101.2 bottom
R18  46.25,14.26 303.7 bottom
R19  24.35,34.26 326.2 bottom
R20  11.33,60.93 348.7 bottom
R21  9.74,90.46 11.2 bottom
R22  19.9,118.4 33.7 bottom
R23  39.59,140.31 56.2 bottom
R24  66.26,153.01 78.7 bottom
R25  95.78,154.28 101.2 bottom
R26  123.72,144.91 123.7 bottom
R27  145.31,124.75 146.2 bottom
R28  158.01,98.4 168.7 bottom
R29  159.6,68.87 191.2 bottom
R30  150.08,40.93 213.7 bottom
R31  130.39,19.34 236.2 bottom
R32  103.72,6.32 258.7 bottom
R33  33.21,82.36 90 top
R34  32,61.98 0 top
R35  51.22,26.94 270 top
R36  51.22,22.97 270 top
R37  51.22,19 270 top
R38  51.22,15.04 270 top
RESET  64.03,26.48 90 top
SJ1  35.16,62.82 90 top
SJ2  128.01,10.29 90 bottom
SJ3  129.44,25.05 180 bottom
START  64.03,16.48 270 top
T1  72.1,4.74 281.2 bottom
T2  44.41,15.37 123.7 bottom
T3  22.89,35.8 146.2 bottom
T4  10.83,62.9 168.7 bottom
T5  10.06,92.55 191.2 bottom
T6  20.7,120.25 213.7 bottom
T7  41.12,141.76 236.2 bottom
T8  68.23,153.82 258.7 bottom
T9  97.88,154.59 281.2 bottom
T10  125.57,143.95 303.7 bottom
T11  147.08,123.53 326.2 bottom
T12  159.14,96.43 348.7 bottom
T13  159.91,66.77 11.2 bottom
T14  149.28,39.08 33.7 bottom
T15  128.85,17.57 56.2 bottom
T16  101.75,5.51 78.7 bottom

### Tracks (layer width: path | path; a pad name or v marks a point on that pad's centre or on a via)
+3V3  (via drill 0.6)
  Top 0.305: 22.47,56.77 C4.2 21.55,58.33 IC1.75 22.76,59.75 22.76,61.16 | C2.2 12.74,69.65 IC1.50 14.27,68.23 14.98,68.23 | 31.65,68.23 31.65,67.83 IC1.100 33.26,66.22 C5.2 34.19,66.2 34.19,64.42 35.03,63.58 SJ1.2 | C6.2 34.39,72.95 33.24,74.11 30.05,74.11 IC1.11 27.82,71.88 22.76,71.88 | C1.2 20.96,81.25 19.9,80.19 19.9,78.16 IC1.28 22.76,75.3 22.76,74.58 24.87,74.58 IC1.19 28.68,78.39 33.87,78.39 35.82,80.34 C3.2 35.86,82.44 34.51,83.79 R33.2 | v55.94,8.22 v76.1,8.22
  Top 0.406: CONTROLL_PANEL.7 CONTROLL_PANEL.8 CONTROLL_PANEL.9 CONTROLL_PANEL.10 CONTROLL_PANEL.11 CONTROLL_PANEL.12 46.89,14.58 50.06,11.4 62.76,11.4 65.3,13.94 START.2 BUTTON.2 65.3,23.15 69.59,27.43 69.59,44.26 88.64,63.31 | v76.1,8.22 v77.21,8.22 v78.32,8.22
  Top 0.61: 22.76,68.23 14.98,68.23 | 22.76,68.23 31.65,68.23 v33.24,68.23 v34.35,68.23 v35.46,68.23 v36.25,69.03 v37.05,69.82 | 22.76,61.16 22.76,68.23 | 22.76,74.58 22.76,71.88 22.76,68.23
  Top 0.813: IC2.3 C10.2 116.32,35.63 88.64,63.31 79.75,72.2 63.5,72.2 C13.1 63.3,72.2 COMPASS.6
  Bottom 0.305: R17.2 74.23,4.61 | R24.2 66.05,153.8 | 19.1,118.87 R22.2 | 95.83,155.23 R25.2 | 160.24,68.55 R29.2
  Bottom 0.406: R19.2 23.64,33.7 | R22.2 19.58,119.35 20.22,119.51 21.17,121.1 22.44,121.26 24.03,120.3 24.66,120.3 | R24.2 66.73,153.96 67.21,153.64 69.11,153.96 70.07,153.64 70.38,151.89 71.34,150.94 | 71.34,150.94 90.23,150.94 94.51,155.23 95.83,155.23 | R25.2 97.05,154.75 98.8,154.43 99.43,153.8 99.43,150.78 | 152.72,41.14 155.79,44.26 155.79,64.26 157.06,65.53 158.97,65.22 159.76,65.69 160.24,68.55 | 46.89,12.35 45.78,13.46 R18.2 45.46,13.78 45.14,14.89 44.61,15.25 | 46.89,12.35 51.02,8.22 v55.94,8.22 v57.21,8.22 v58.32,8.22 v59.43,8.22 | v76.1,8.22 98.96,8.22 99.43,7.75 99.75,6 101.02,5.37 102.77,5.69 R32.2 106.26,5.49 | 75.23,5.61 74.23,4.61 | 75.23,5.61 76.1,6.48 v76.1,8.22 | v76.1,8.22 v74.99,8.22 v73.88,8.22 | 131.5,19.18 130.95,18.63 R31.2 130.07,18.38 128.01,17.12 127.22,17.12 124.99,19.5 117.69,19.5 113.56,15.37 113.56,8.22 110.82,5.49 106.26,5.49 | 131.5,25.05 131.5,19.18 | 44.67,15.21 44.61,15.25 | 44.61,15.25 43.4,16.16 43.4,16.96 44.51,19.02 44.51,22.99 34.82,32.67 25.93,32.67 | R19.2 23.39,35.05 22.44,36.64 22.6,37.75 24.03,38.7 24.03,44.9 11.73,57.2 | SJ3.2 131.5,25.05 | 145.47,120.3 145.79,120.62 147.38,121.57 147.69,122.53 R27.2 146.02,126.58 135.79,136.81 128.8,136.81 126.58,139.04 | 145.47,120.3 145.47,118.24 152.3,111.41 152.3,108.24 158.85,101.69 158.85,101.25 | 126.58,139.04 125.79,139.83 125.79,141.1 126.74,142.53 126.58,143.32 124.88,144.4 R26.2 123.16,146.66 102.93,146.66 99.43,150.15 99.43,150.78 | 66.05,153.8 65.14,153.8 51.81,140.46 44.19,140.46 43.08,142.21 41.97,142.37 40.38,141.26 39.74,141.42 R23.2 36.89,141.01 | 19.1,118.87 18.63,118.4 18.63,114.11 14.03,109.51 14.03,94.43 13.39,93.79 12.92,93.79 11.01,94.11 10.38,93.63 9.9,91.89 R21.2 8.91,87.28
  Bottom 0.406: 8.91,87.28 8.91,73.19 13.71,68.39 13.71,65.85 12.92,65.06 11.17,64.74 10.69,63.79 10.85,62.52 10.69,61.41 R20.2 10.53,58.39 11.73,57.2 | R19.2 24.75,32.67 25.93,32.67 | 160.43,70.77 R29.2 | 160.43,70.77 160.43,80.73 156.11,85.06 156.11,93.31 157.06,94.27 158.65,94.58 159.28,95.38 R28.2 158.85,101.25 | 24.66,120.3 25.3,120.3 27.2,122.21 27.2,132.21 36.01,141.01 36.89,141.01 | IC2.3 137.06,31.4 131.5,25.85 131.5,25.05 | C15.2 25.93,30.98 25.93,32.67 | C16.2 12.92,58.39 11.73,57.2 | C17.2 10.48,87.28 8.91,87.28 | C18.2 24.66,118.4 24.66,120.3 | C19.2 36.89,141.01 | C20.2 70.22,149.83 71.34,150.94 | C21.2 99.43,150.78 | C22.2 125.95,138.4 126.58,139.04 | C23.2 144.53,120.3 145.47,120.3 | C24.2 158.85,101.25 | C25.2 160.43,70.77 | C26.2 153.57,40.29 152.72,41.14 | C27.2 132.87,17.81 131.5,19.18 | C28.2 106.26,3.36 106.26,5.49 | C29.2 76.1,4.73 75.23,5.61 | C30.2 47.52,12.99 46.89,12.35 | R30.2 152.04,40.46 152.72,41.14
  Bottom 0.61: v33.24,68.23 v35.46,68.23 v37.05,69.82 39.43,72.2 BLUETOOTH.4
  Bottom 0.813: COMPASS.6 57.21,72.2 54.19,69.19 46.41,69.19 44.98,70.61 BLUETOOTH.4
+5V
  Top 0.813: C14.2 IC3.3
  Bottom 0.813: IC3.3 112.93,35.21 98.96,49.18 FAN.2
B1
  Top 0.305: IC1.56 10.53,60.96 10.53,52.99 31.17,32.36 44.03,32.36 46.89,29.5 CONTROLL_PANEL.1
B2
  Top 0.305: IC1.55 9.9,61.03 9.9,52.67 30.85,31.72 42.76,31.72 44.35,30.13 CONTROLL_PANEL.2
B3
  Top 0.305: IC1.54 9.26,61.1 9.26,52.36 30.54,31.08 40.86,31.08 41.81,30.13 CONTROLL_PANEL.3
B4
  Top 0.305: IC1.53 8.63,61.17 8.63,52.04 30.22,30.45 38.32,30.45 39.27,29.5 CONTROLL_PANEL.4
B5
  Top 0.305: IC1.52 7.99,61.25 7.99,51.72 29.9,29.82 36.09,29.82 36.73,29.18 CONTROLL_PANEL.5
B6
  Top 0.305: IC1.51 7.36,61.32 7.36,51.41 29.58,29.18 32.6,29.18 33.39,28.39 34.08,28.39 CONTROLL_PANEL.6
BL_RX
  Top 0.305: IC1.79 26.87,57.76 37.52,57.76 41.65,61.88 53.71,61.88 54.51,62.68 54.51,68.39 53.56,69.34 50.86,69.34 50.06,70.14 BLUETOOTH.2
BL_TX
  Top 0.305: IC1.78 26.8,57.12 37.68,57.12 41.81,61.25 54.03,61.25 55.14,62.36 55.14,70.77 53.71,72.2 BLUETOOTH.1
COM1
  Top 0.406: DRIVER1.2 111.66,69.5 112.93,70.77 116.74,70.77 123.09,64.42 DRIVER2.4
COM2
  Top 0.406: DRIVER2.2 124.36,69.5 125.63,70.77 129.44,70.77 135.79,64.42 DRIVER\3.4
COM3
  Top 0.406: DRIVER\3.2 137.06,69.5 138.33,70.77 142.14,70.77 148.49,64.42 DRIVER4.4
COMPASS_RX
  Top 0.305: IC1.69 18.15,59.39 18.15,56.96 35.11,40.01 46.13,40.01 52.44,46.33 52.44,58.71 58.32,64.58 COMPASS.3
COMPASS_TX
  Top 0.305: IC1.68 17.55,59.49 17.55,56.64 34.7,39.34 46.35,39.34 53.08,46.07 53.08,58.39 56.73,62.04 COMPASS.2
DEBUG_RX
  Top 0.305: IC1.48 11.24,72.68 8.79,72.68 6.72,70.61 6.72,51.09 31.65,26.16 31.65,19.02 33.55,17.12 41.97,17.12 52.29,6.8 124.99,6.8 131.18,12.99 131.18,20.45 136.11,25.37 137.48,25.37 DEBUG.3
DEBUG_TX
  Top 0.305: DEBUG.2 138.01,21.25 138.01,19.02 125.15,6.16 52.13,6.16 41.68,16.61 33.34,16.61 31.14,18.81 31.14,25.72 6.09,50.77 6.09,70.93 8.47,73.31 11.33,73.31 13.92,70.72 IC1.47
GND  (via drill 0.6, 3.2 pad 6.45)
  Top 0.305: 30.54,67.28 31.49,67.28 IC1.99 33.24,65.53 | 21.33,56.64 20.38,57.6 20.38,58.07 IC1.74 21.81,59.5 21.81,59.98 | IC1.27 21.65,77.12 22.6,77.12 | IC1.20 25.27,75.69 24.03,75.69 | 28.16,70.3 28.16,71.51 IC1.10 30.28,73.63 31.17,73.63 31.81,72.99 31.81,72.33 IC1.6
  other vias: 21.49,69.82 21.49,70.77 20.54,70.77 20.54,69.82 24.98,69.82 24.98,70.77 24.03,70.77 24.03,69.82 24.98,65.69 24.98,66.65 24.03,66.65 24.03,65.69 21.49,65.69 21.49,66.65 20.54,66.65 20.54,65.69 69.99,94.66 99.99,94.66 99.99,64.66 69.99,64.66
  pour Bottom: -26.77,172.37 -25.5,-7.97 175.16,-7.97 173.89,172.37
  pour Top: 172.62,-6.7 172.62,171.1 -24.23,171.1 -24.23,-6.7
GO
  Top 0.305: IC1.61 13.71,60.6 13.71,54.82 33,35.53 46.41,35.53 50.06,31.88 55.14,31.88 59.59,27.43 59.59,17.27 60.38,16.48 START.1
JETSON_RX
  Top 0.305: IC1.64 15.61,60.38 15.61,55.69 33.87,37.44 47.05,37.44 48.48,38.86 60.7,38.86 61.97,37.59 JETSON.3
JETSON_TX
  Top 0.305: IC1.63 14.98,60.45 14.98,55.37 33.55,36.8 47.05,36.8 50.7,33.15 64.03,33.15 64.51,33.62 JETSON.2
KICKER_RX
  Top 0.305: IC1.83 28.43,59.03 37.05,59.03 44.98,66.96 51.65,66.96 52.76,65.85 KICKER.3
KICKER_TX
  Top 0.305: IC1.80 26.98,58.36 37.26,58.36 43.48,64.58 KICKER.1
LED0
  Top 0.305: IC1.57 11.17,60.89 11.17,53.31 31.49,32.99 45.14,32.99 48.79,29.34 54.51,29.34 56.14,27.71 LED20.A
LED1
  Top 0.305: IC1.58 11.84,60.83 11.84,53.68 31.86,33.66 45.43,33.66 49.11,29.97 54.67,29.97 57.68,26.96 57.68,22.83 57.05,22.19 56.25,22.19 LED17.A
LED2
  Top 0.305: IC1.59 12.44,60.74 12.44,54.1 32.28,34.26 45.78,34.26 49.43,30.61 54.83,30.61 58.32,27.12 58.32,18.95 57.48,18.11 LED18.A
LED3
  Top 0.305: IC1.60 13.07,60.67 13.07,54.42 32.6,34.9 46.09,34.9 49.75,31.24 54.98,31.24 58.95,27.27 58.95,15.69 57.42,14.15 LED19.A
M1_OUT1
  Bottom 1.27: DRIVER1.13 DRIVER1.14 DRIVER1.12 | DRIVER1.12 DRIVER1.11 | MOTOR1.IN1 113.64,79.1 105.31,70.77 105.31,58.07 109.12,54.26 DRIVER1.12
M1_OUT2
  Bottom 1.27: DRIVER1.9 DRIVER1.10 DRIVER1.8 | DRIVER1.8 DRIVER1.7 | MOTOR1.IN2 113.49,75.14 107.85,69.5 107.85,61.88 110.39,59.34 DRIVER1.8
M2_OUT1
  Bottom 1.27: DRIVER2.13 DRIVER2.14 DRIVER2.12 | DRIVER2.12 DRIVER2.11 | MOTOR2.IN1 128.88,79.1 119.28,69.5 119.28,56.8 121.82,54.26 DRIVER2.12
M2_OUT2
  Bottom 1.27: DRIVER2.9 DRIVER2.10 DRIVER2.8 | DRIVER2.8 DRIVER2.7 | MOTOR2.IN2 128.73,75.14 121.82,68.23 121.82,60.61 123.09,59.34 DRIVER2.8
M3_OUT1
  Bottom 1.27: DRIVER\3.13 DRIVER\3.14 DRIVER\3.12 | DRIVER\3.11 DRIVER\3.12 | MOTOR3.IN1 141.58,79.1 130.71,68.23 130.71,58.07 134.52,54.26 DRIVER\3.12
M3_OUT2
  Bottom 1.27: DRIVER\3.9 DRIVER\3.10 DRIVER\3.8 | DRIVER\3.8 DRIVER\3.7 | MOTOR3.IN2 141.43,75.14 133.25,66.96 133.25,60.61 134.52,59.34 DRIVER\3.8
M4_OUT1
  Bottom 1.27: DRIVER4.13 DRIVER4.14 DRIVER4.12 | DRIVER4.12 DRIVER4.11 | MOTOR4.IN1 154.28,79.1 143.41,68.23 143.41,56.8 145.95,54.26 DRIVER4.12
M4_OUT2
  Bottom 1.27: DRIVER4.9 DRIVER4.10 DRIVER4.8 | DRIVER4.8 DRIVER4.7 | MOTOR4.IN2 154.13,75.14 145.95,66.96 145.95,61.88 148.49,59.34 DRIVER4.8
MOTOR_RX
  Top 0.305: DRIVER4.2 143.41,73.31 102.29,73.31 98.48,77.12 45.94,77.12 42.28,73.47 42.28,66.17 36.41,60.3 29.99,60.3 IC1.87
MOTOR_TX
  Top 0.305: IC1.86 29.92,59.66 36.73,59.66 42.92,65.85 42.92,73.31 46.09,76.49 98.32,76.49 110.39,64.42 DRIVER1.4
N$1
  Bottom 0.305: R1.1 66.73,7.43 LED1.A
N$2
  Bottom 0.305: R2.1 40.54,19.81 LED2.A
N$3
  Bottom 0.305: R3.1 20.38,41.56 21.01,41.56 LED3.A
N$4
  Bottom 0.406: LED4.A 11.33,68.71 R4.1
N$5
  Bottom 0.305: R5.1 12.76,97.92 LED5.A
N$6
  Bottom 0.406: LED6.A 25.3,124.27 R6.1
N$7
  Bottom 0.406: LED7.A 46.73,143.64 R7.1
N$8
  Bottom 0.406: R8.1 74.35,153.48 LED8.A
N$9
  Bottom 0.406: R9.1 103.24,151.89 LED9.A
N$10
  Bottom 0.406: R10.1 129.6,139.51 LED10.A
N$11
  Bottom 0.406: R11.1 149.12,117.76 LED11.A
N$12
  Bottom 0.406: R12.1 158.65,90.46 LED12.A
N$13
  Bottom 0.406: R13.1 157.22,61.56 LED13.A
N$14
  Bottom 0.406: R14.1 144.84,35.37 LED14.A
N$15
  Bottom 0.406: R15.1 123.25,15.69 LED15.A
N$16
  Bottom 0.406: R16.1 95.78,5.84 LED16.A
N$17
  Top 0.305: IC1.49 12.56,70.65 C7.2
N$18
  Top 0.305: IC1.73 19.58,57.99 19.58,57.44 22.88,54.14 C8.2
N$19
  Top 0.305: 25.25,77.07 IC1.22 IC1.21 27.9,79.03 32.44,79.03 33.21,79.8 R33.1 33.2,80.77 31.97,80.77 30.76,81.98 C12.1
N$20
  Top 0.305: IC1.94 32.85,62.38 R34.2 35.08,61.98 SJ1.1
N$21  (via drill 0.6)
  Top 0.406: v83.08,155.86 v86.42,155.86 v100.55,155.86 v101.66,155.86
  Bottom 0.305: 71.79,156.36 71.02,157.13 65.94,157.13 65.78,156.97
  Bottom 0.406: LED16.C 98.18,2.69 96.42,0.92 70.99,0.92 LED1.C 67.34,3.46 49.59,3.46 41.97,11.08 40.54,11.08 | 40.26,15.89 LED2.C 40.54,16 40.54,11.08 | 8.1,66.91 LED4.C 8.05,66.96 3.07,66.96 | 20.23,125.52 17.36,120.62 17.36,114.91 12.6,110.14 12.6,106.33 6.25,99.98 6.25,96.65 | 20.23,125.52 21.17,126.97 21.81,126.97 25.77,130.94 25.77,133.48 40.54,148.24 | LED6.C 20.23,125.52 | v86.42,155.86 v85.31,155.86 v84.19,155.86 v83.08,155.86 77.84,155.86 77.21,156.5 72.18,156.5 LED8.C 71.79,156.36 | v100.55,155.86 101.53,155.86 LED9.C 102.58,155.86 120.55,155.86 131.34,145.07 | 151.94,121.83 148.17,127.92 147.22,127.92 137.06,138.08 137.06,139.35 131.34,145.07 | 151.94,121.83 154.52,117.6 154.52,107.92 165.22,97.22 165.22,92.68 | 151.95,31.74 132.61,12.51 128.01,12.51 | 128.01,12.51 LED15.C | 128.01,12.51 SJ2.2 | LED14.C 148.76,34.94 151.95,31.74 | 151.95,31.74 157.22,37.17 157.22,51.25 165.22,59.09 165.22,63.15 | LED13.C 161.22,63.15 165.22,63.15 | LED12.C 161.61,92.68 165.22,92.68 | LED10.C 129.71,143.44 131.34,145.07 | 65.78,156.97 59.59,150.78 43.08,150.78 40.54,148.24 | LED7.C 40.54,148.24 | 6.25,96.65 6.25,73.31 3.07,70.14 3.07,66.96 | LED5.C 6.33,96.73 6.25,96.65 | 3.07,66.96 3.07,62.52 12.6,52.99 12.6,37.75 15.77,34.58 | 15.77,34.58 39.27,11.08 40.54,11.08 | LED3.C 15.77,34.58 | LED11.C 151.94,121.83 | 165.22,63.15 165.22,92.68
N$22  (via drill 0.6)
  Top 0.406: v4.5,65.53 v4.5,68.39 4.42,82.41 4.42,93.07 v10.53,99.19 10.53,106.02 23.71,119.19 v23.71,126.18 23.71,129.19 40.54,146.02 v46.09,146.02 55.14,155.07 v74.51,155.07 75.46,154.12 v104.51,154.12 118.64,154.12 v131.66,141.1 151.35,121.26 v151.35,118.56 151.35,109.83 161.19,99.98 v161.19,90.14 161.19,62.04 v159.44,60.3 159.44,46.33 v146.27,33.15 | v15.14,39.02 15.14,32.99 33.39,14.89 v37.52,14.89 47.36,4.73 v65.46,4.73 67.21,3.3 v95.47,3.3 | v123.88,13.3 123.88,20.29 v128.64,25.05
  Bottom 0.305: v104.51,154.12 R9.2 | v131.66,141.1 R10.2 | v151.35,118.56 R11.2 | R8.2 v74.51,155.07 | v46.09,146.02 R7.2 | v23.71,126.18 R6.2 | v10.53,99.19 R5.2 | v161.19,90.14 R12.2 | v159.44,60.3 R13.2 | v146.27,33.15 R14.2
  Bottom 0.406: SJ3.1 v128.64,25.05 | v123.88,13.3 R15.2 123.88,10.76 114.52,1.4 101.02,1.4 100.39,2.03 100.39,2.67 100.07,4.41 99.12,4.89 96.89,4.41 R16.2 v95.47,3.3 | v65.46,4.73 R1.2 | v4.5,65.53 4.5,62.83 15.14,52.2 v15.14,39.02 16.81,39.02 R3.2 | v4.5,68.39 7.96,68.39 R4.2 | v37.52,14.89 37.52,17.2 R2.2
N$23
  Top 0.305: R35.2 53.13,26.05 LED20.C
N$24
  Top 0.305: R36.2 LED17.C
N$25
  Top 0.305: R37.2 LED18.C
N$26
  Top 0.305: R38.2 53.29,14.14 LED19.C
N$28
  Top 1.93: BATTERY.IN1 107.21,12.35 107.21,15.84 111.1,19.73 KEY.IN2
PS0
  Top 0.305: IC1.65 16.25,60.31 16.25,56.01 34.19,38.07 46.83,38.07 54.29,45.53 54.29,50.71 56.73,53.15 COMPASS_MODE.1
PS1
  Top 0.305: IC1.66 16.88,60.24 16.88,56.33 34.51,38.7 46.59,38.7 53.71,45.83 53.71,53.15 56.25,55.69 COMPASS_MODE.2
RST  (via drill 0.6)
  Top 0.305: IC1.14 29.04,75.22 35.78,75.22 v40.7,70.3
  Bottom 0.305: 52.44,47.91 52.44,58.55 50.38,60.61 48.16,60.61 40.7,68.07 v40.7,70.3 | 52.44,47.91 48.92,47.91 PROGRAMMER.1 | 52.44,47.91 52.44,33.47 55.78,30.13 63.56,30.13 65.3,28.39 RESET.1
S1  (via drill 0.6)
  Top 0.305: IC1.36 17.19,75.22 16.25,75.22 v14.03,72.99
  Bottom 0.305: v14.03,72.99 14.03,72.28 19.27,67.05 19.27,53.63 64.19,8.7 69.75,8.7 70.54,7.91 70.54,4.24 T1.C
  Bottom 0.406: T1.C R17.1
S2  (via drill 0.6)
  Top 0.305: IC1.35 17.26,75.85 15.3,75.85 v14.03,74.58
  Bottom 0.305: T2.C 45.62,17.07 45.62,26.32 18.63,53.31 18.63,66.8 12.76,72.68 12.76,73.31 v14.03,74.58
  Bottom 0.406: T2.C 46.57,15.96 R18.1
S3  (via drill 0.6)
  Top 0.305: IC1.34 17.33,76.49 14.34,76.49 v14.03,76.17
  Bottom 0.305: v14.03,76.17 12.12,74.27 12.12,72.36 18,66.49 18,52.99 26.41,44.58 26.41,38.55 24.63,36.77
  Bottom 0.406: R19.1 25.05,35.59 T3.C 24.63,36.77
S4  (via drill 0.6)
  Top 0.305: IC1.33 17.4,77.12 14.66,77.12 v14.03,77.76
  Bottom 0.305: v14.03,77.76 11.49,75.22 11.49,72.2 14.79,68.9 14.79,65.69 14.79,65.34 14.79,64.55 13.55,63.31 12.62,63.31 T4.C
  Bottom 0.406: R20.1 12.55,61.48 T4.C
S5  (via drill 0.6)
  Top 0.305: IC1.32 17.48,77.76 15.61,77.76 v14.03,79.34
  Bottom 0.305: R21.1 10.57,91.01 T5.C | R21.1 10.69,90.17 | v14.03,79.34 12.6,80.77 12.6,88.55 10.86,90.29 R21.1
S6  (via drill 0.6)
  Top 0.305: IC1.31 17.55,78.39 16.57,78.39 v15.61,79.34
  Bottom 0.305: v15.61,79.34 13.23,81.73 13.23,91.41 14.66,92.84 14.66,109.19 20.54,115.06 20.54,117.85 R22.1
  Bottom 0.406: 20.81,117.93 R22.1 21.49,118.24 T6.C
S7  (via drill 0.6)
  Top 0.305: v17.2,79.34 17.3,79.34 IC1.30
  Bottom 0.305: T7.C 64.03,118.37 64.03,94.9 53.87,84.74 27.04,84.74 24.35,82.04 21.25,82.04 19.82,80.62 18.47,80.62 v17.2,79.34
  Bottom 0.406: T7.C 41.39,139.6 R23.1
S8  (via drill 0.6)
  Top 0.305: IC1.29 18.79,78.57 v18.79,79.34
  Bottom 0.305: v18.79,79.34 19.42,79.98 20.06,79.98 21.46,81.38 24.47,81.38 27.2,84.11 54.19,84.11 64.67,94.58 64.67,151.1 65.74,152.17 R24.1
  Bottom 0.406: T8.C 66.49,152.1 R24.1
S9  (via drill 0.6)
  Top 0.305: IC1.26 21.65,78.44 v21.65,79.34
  Bottom 0.305: R25.1 95.27,153.44 90.07,148.24 69.75,148.24 65.34,143.83 65.34,94.3 54.51,83.47 27.45,83.47 24.52,80.55 22.85,80.55 v21.65,79.34
  Bottom 0.406: T9.C 96.19,152.87 R25.1
S10  (via drill 0.6)
  Top 0.305: v28,81.89 27.93,81.89 IC1.25
  Bottom 0.305: T10.C 104.04,121.94 104.04,85.06 99.28,80.3 39.59,80.3 38,81.89 v28,81.89
  Bottom 0.406: 124.6,142.7 T10.C 123.41,143.32 R26.1
S11  (via drill 0.6)
  Top 0.305: IC1.24 27.68,80.93 v29.27,80.93
  Bottom 0.305: R27.1 144.52,124.28 134.52,134.27 117.37,134.27 104.67,121.57 104.67,84.74 99.59,79.66 39.27,79.66 38,80.93 v29.27,80.93
  Bottom 0.406: R27.1 T11.C
S12  (via drill 0.6)
  Top 0.305: IC1.23 27.43,79.98 v30.54,79.98
  Bottom 0.305: T12.C 157.29,96.08 145.31,84.11 104.99,84.11 99.91,79.03 38.95,79.03 38,79.98 v30.54,79.98
  Bottom 0.406: R28.1 157.43,97.98 T12.C
S13  (via drill 0.6)
  Top 0.305: IC1.18 28.75,77.76 36.73,77.76 v37.36,78.39
  Bottom 0.305: R29.1 158.65,69.15 158.65,71.09 159.44,71.88 159.44,80.14 156.11,83.47 105.31,83.47 100.23,78.39 v37.36,78.39
  Bottom 0.406: R29.1 158.51,68.78 T13.C
S14  (via drill 0.6)
  Top 0.305: IC1.17 28.82,77.12 38.16,77.12 v38.47,77.28
  Bottom 0.305: v38.47,77.28 74.83,77.28 112.22,40.05 T14.C
  Bottom 0.406: R30.1 149.17,41.4 T14.C
S15  (via drill 0.6)
  Top 0.305: IC1.16 28.89,76.49 37.68,76.49 38,76.17 v39.59,76.17
  Bottom 0.305: v39.59,76.17 74.99,76.17 129.92,21.56 R31.1
  Bottom 0.406: R31.1 T15.C
S16  (via drill 0.6)
  Top 0.305: IC1.15 28.96,75.85 37.36,75.85 38.16,75.06 v40.7,75.06
  Bottom 0.305: v40.7,75.06 75.15,75.06 115.47,34.74 115.47,31.88 112.45,28.86 108.17,28.86 104.67,25.37 104.67,8.22 103.6,7.15 R32.1
  Bottom 0.406: T16.C 101.48,7.15 R32.1
SYS_SWCLK
  Top 0.305: IC1.76 29.74,52.76 29.74,47.2 35.7,41.25 44.03,41.25 45.14,42.36 45.14,43.47 44.52,44.73 PROGRAMMER.3
SYS_SWDIO
  Top 0.305: IC1.72 18.79,57.9 18.79,57.28 35.4,40.67 45.84,40.67 47.52,42.36 47.52,44.41 PROGRAMMER.2
TEST_KICK
  Top 0.305: IC1.62 14.34,60.53 14.34,55.06 33.24,36.16 46.73,36.16 50.38,32.51 55.3,32.51 60.22,27.59 60.22,25.69 62.76,23.15 BUTTON.1
VCC
  Top 0.813: C11.2 IC3.1
  Top 1.016: C9.2 IC2.1
  Top 1.676: IC2.1 131.98,28.86
  Top 1.93: DRIVER1.16 DRIVER1.15 | DRIVER1.15 DRIVER1.17 | DRIVER2.15 DRIVER2.16 DRIVER1.15 | DRIVER2.15 DRIVER2.17 | DRIVER2.15 DRIVER\3.16 DRIVER\3.15 | DRIVER\3.15 DRIVER\3.17 | 144.68,49.18 DRIVER\3.15 | 144.68,49.18 DRIVER4.16 DRIVER4.15 DRIVER4.17 | KICKER_POWER.IN1 DEBUG_POWER.IN1 116.03,28.79 116.1,28.86 | 116.1,28.86 131.98,28.86 138.33,28.86 144.68,35.21 144.68,49.18 | 109.44,28.86 116.1,28.86 | KEY.IN1 107.14,26.57 109.44,28.86 | IC3.1 107.85,30.13 109.12,28.86 109.44,28.86

### Text on the board
tDocu: POLOLU_5v | POLOLU_3v3